# EAGLE board LabFriendMain1 (EAGLE 7.7.0), part 1 of 4
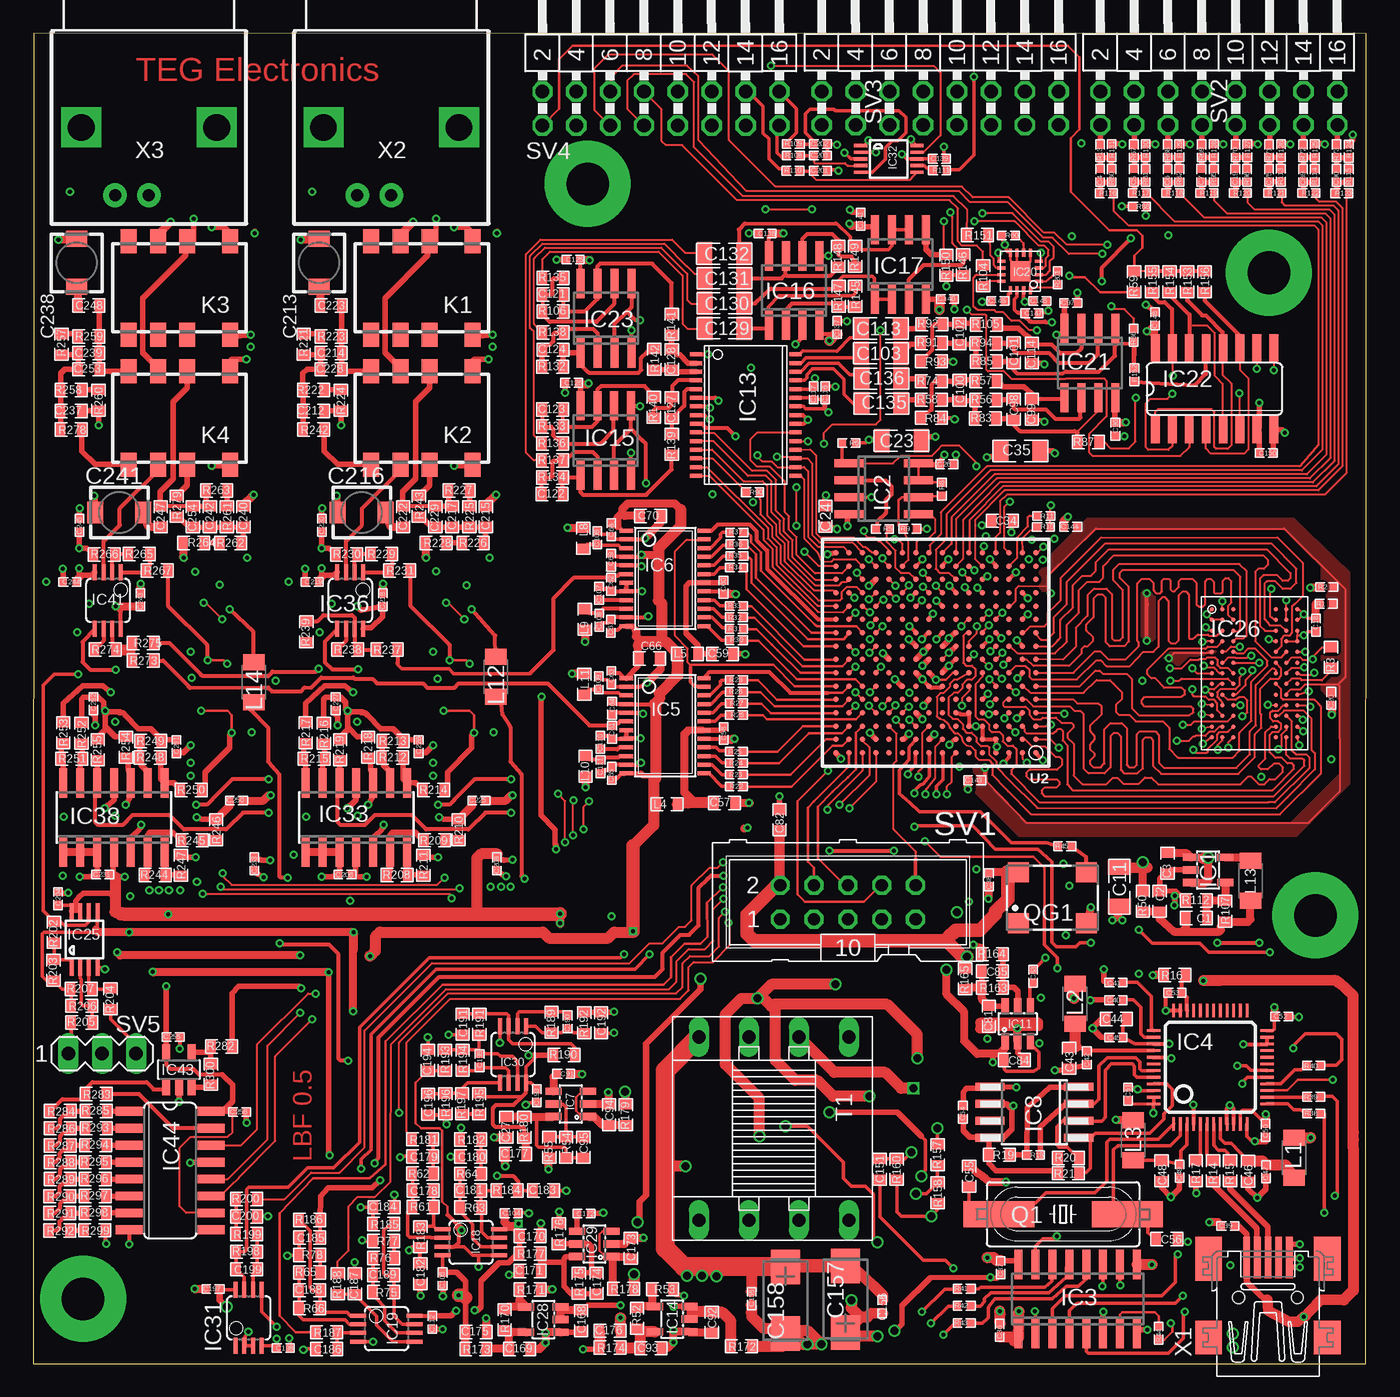
[diagram p13: board, top side]
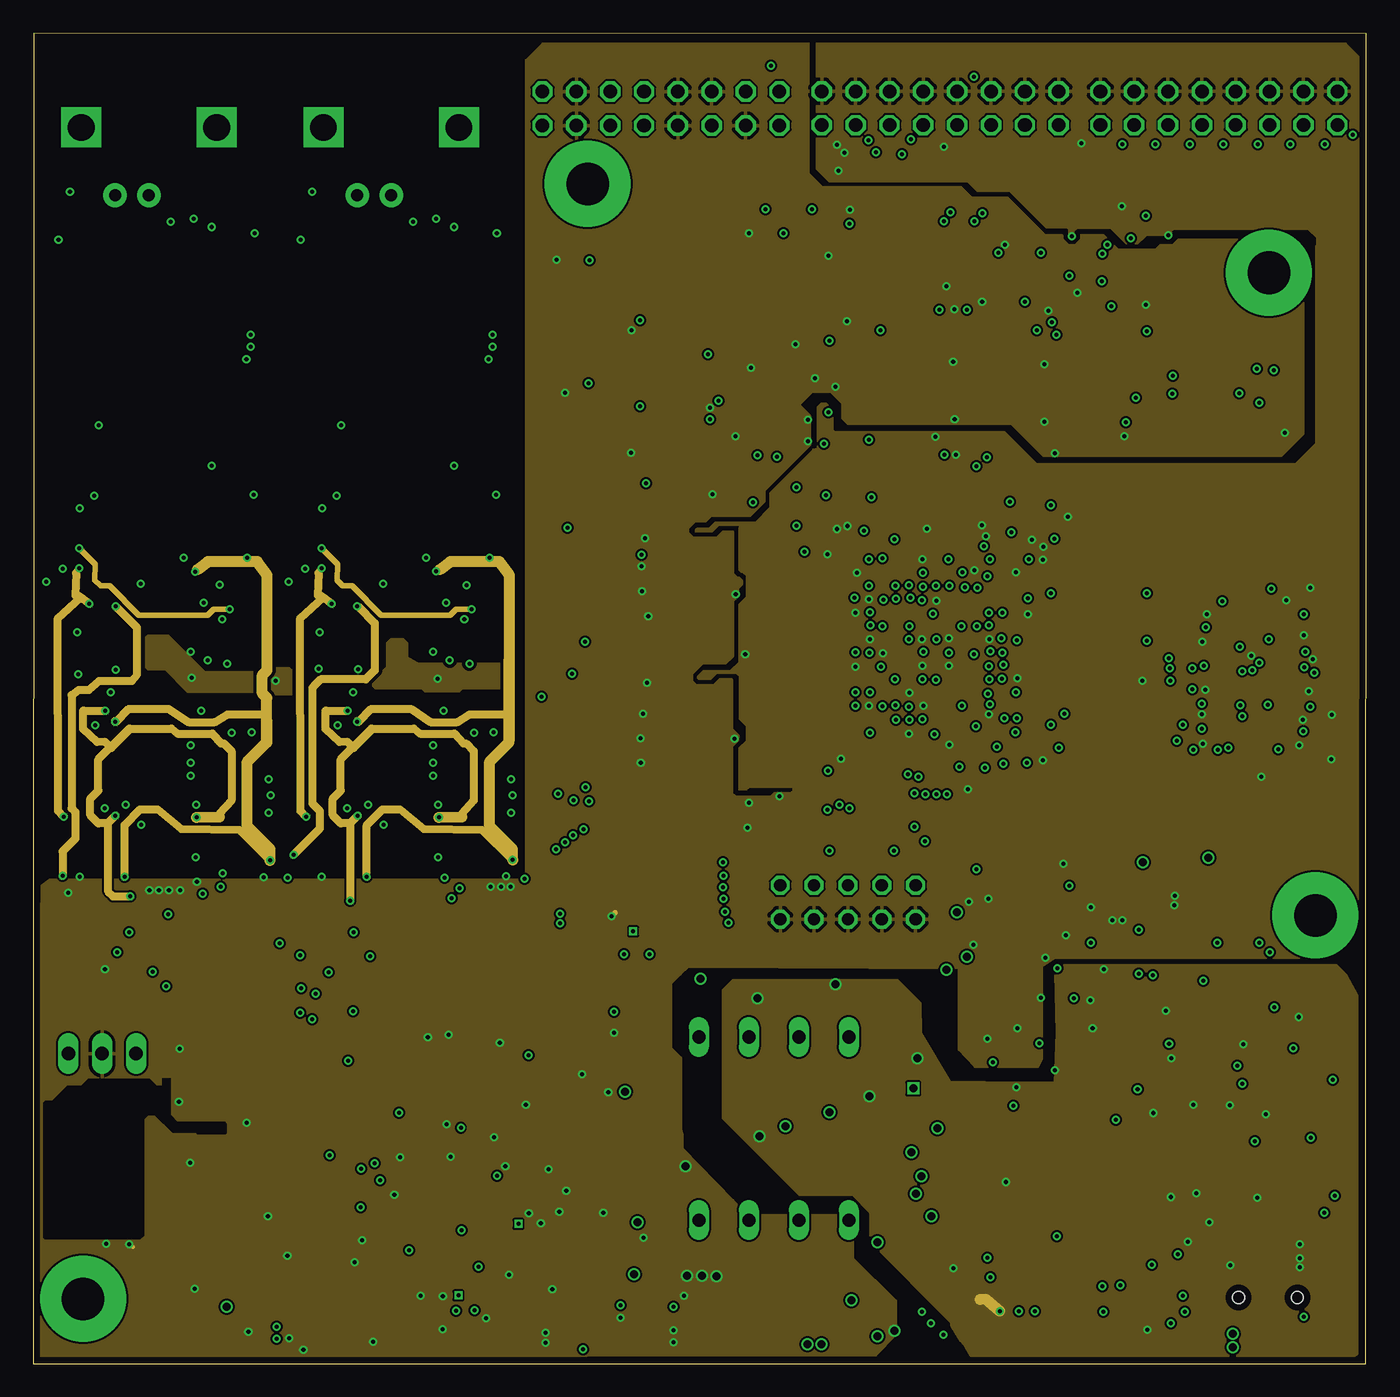
[diagram p14: board, inner layer Route2]
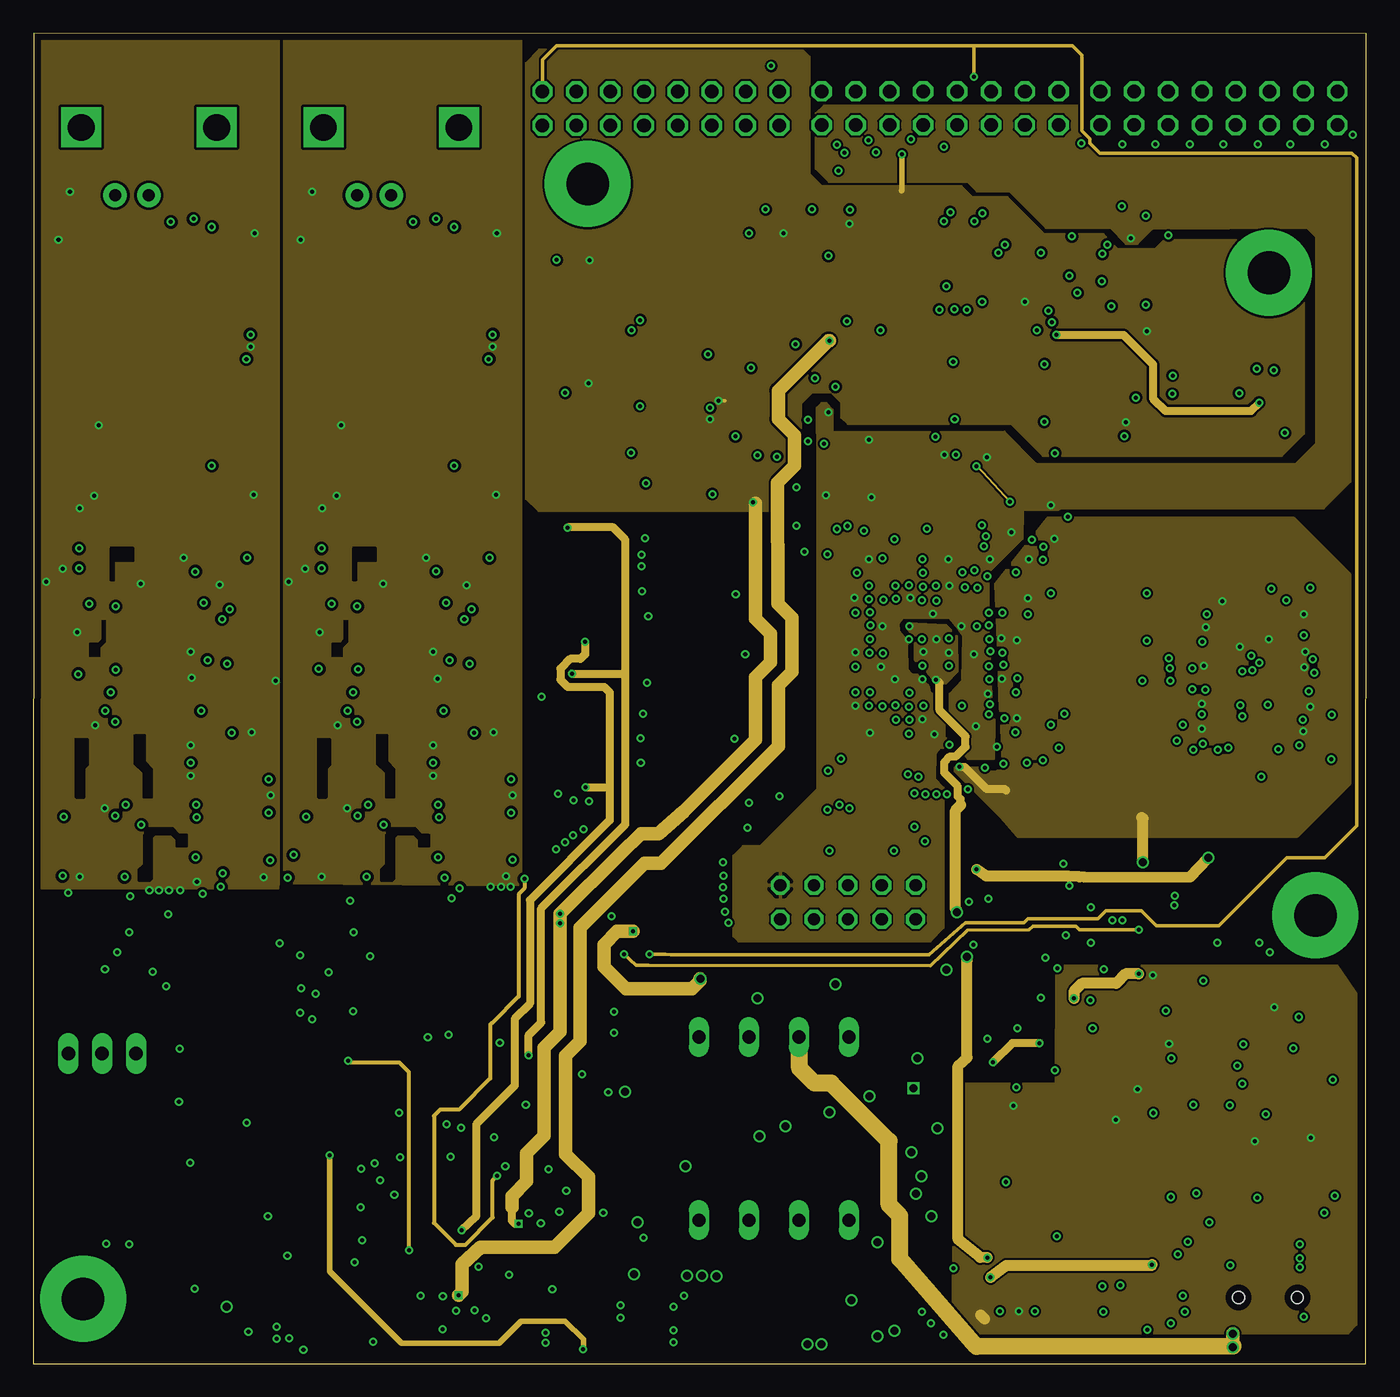
[diagram p15: board, inner layer Route3]
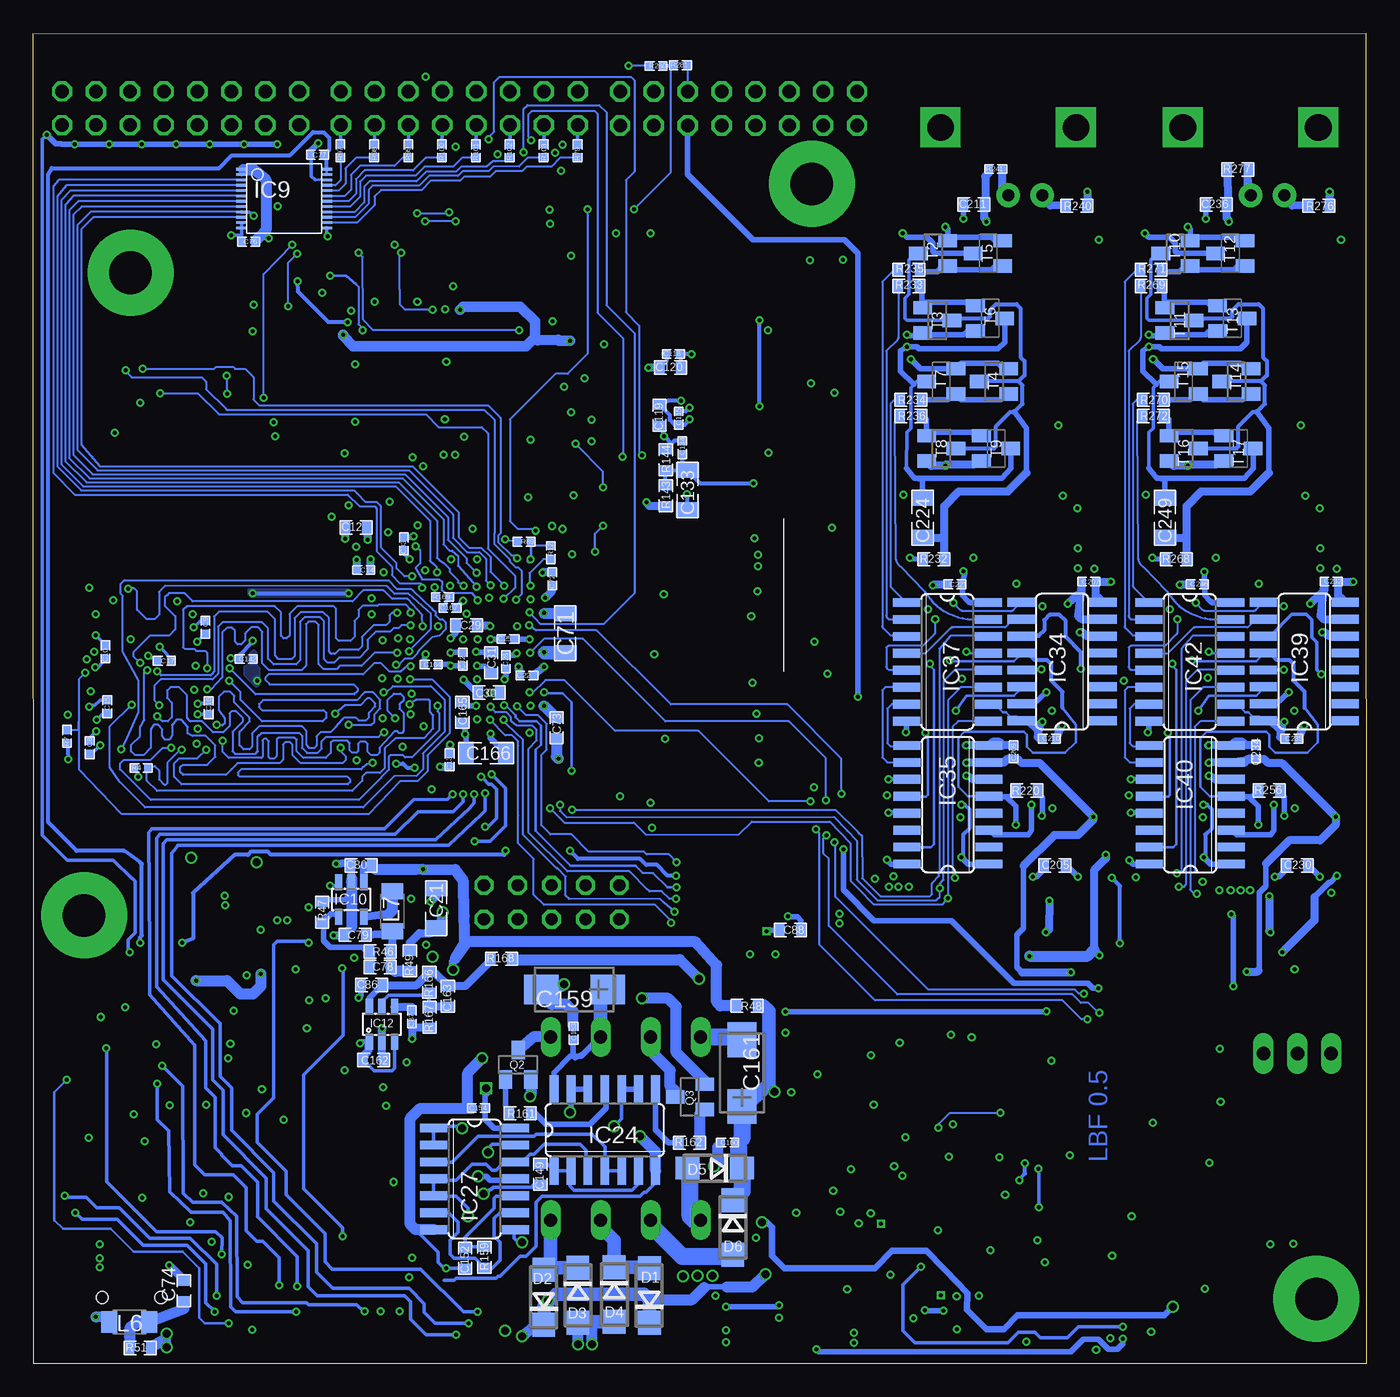
[diagram p16: board, bottom side, seen from below]

Size 100 x 99.78 mm. Coordinates in mm from the lower left corner, seen from the top.
Outline: 0,0 99.98,0 100,99.75 0.02,99.78 0,0
Copper layers (1+2*3+16): Top 0.035mm / dielectric 0.3mm / Route2 0.035mm / dielectric 0.7mm / Route3 0.035mm / dielectric 0.3mm / Bottom 0.035mm
Design rules "default *": minimum track width 0.15mm, minimum drill 0.3mm, track to track 0.15mm, track to pad 0.15mm, pad to pad 0.15mm, via to via 0.15mm, smd to smd 0mil, copper to edge 20mil, drill to drill 8mil, minimum pad ring 10mil, minimum via ring 0.15mm, stop-mask expansion 4mil, vias tented up to drill 16mil, thermal gap 10mil

## Footprints (pad centres in the part's own frame; a part is rotated, then mirrored left to right if it is on the bottom)
0603 = smd 0.762 x 0.965: 1 -0.787,0; 2 0.787,0
0402 = smd 0.635 x 0.635: 1 -0.498,0; 2 0.523,0
1206 = smd 1.143 x 1.702: 1 -1.473,0; 2 1.473,0
CT6032 = smd 2.6 x 2.2: + -2.5,0; - 2.5,0
CTRIMTZBX4 = smd 1.6 x 1.2: 1 0,1.8; 2 0,-1.8
DO214AC = smd 1.8 x 1.7: A 2.05,0; C -2.05,0
SOT23-5L = smd 0.55 x 1.2: 1 -0.95,-1.3; 2 0,-1.3; 3 0.95,-1.3; 4 0.95,1.3; 5 -0.95,1.3
SO-08 = smd 0.6 x 2.2: 1 -1.905,-2.6; 2 -0.635,-2.6; 3 0.635,-2.6; 4 1.905,-2.6; 5 1.905,2.6; 6 0.635,2.6; 7 -0.635,2.6; 8 -1.905,2.6
SO16 = smd 0.6 x 2.2: 1 -4.445,-2.6; 2 -3.175,-2.6; 3 -1.905,-2.6; 4 -0.635,-2.6; 5 0.635,-2.6; 6 1.905,-2.6; 7 3.175,-2.6; 8 4.445,-2.6; 9 4.445,2.6; 10 3.175,2.6; 11 1.905,2.6; 12 0.635,2.6; 13 -0.635,2.6; 14 -1.905,2.6; 15 -3.175,2.6; 16 -4.445,2.6
LQFP48 = smd 0.2 x 1: 1 -2.75,-4.25; 2 -2.25,-4.25; 3 -1.75,-4.25; 4 -1.25,-4.25; 5 -0.75,-4.25; 6 -0.25,-4.25; 7 0.25,-4.25; 8 0.75,-4.25; 9 1.25,-4.25; 10 1.75,-4.25; 11 2.25,-4.25; 12 2.75,-4.25; 25 2.75,4.25; 26 2.25,4.25; 27 1.75,4.25; 28 1.25,4.25; 29 0.75,4.25; 30 0.25,4.25; 31 -0.25,4.25; 32 -0.75,4.25; 33 -1.25,4.25; 34 -1.75,4.25; 35 -2.25,4.25; 36 -2.75,4.25 | smd 1 x 0.2: 13 4.25,-2.75; 14 4.25,-2.25; 15 4.25,-1.75; 16 4.25,-1.25; 17 4.25,-0.75; 18 4.25,-0.25; 19 4.25,0.25; 20 4.25,0.75; 21 4.25,1.25; 22 4.25,1.75; 23 4.25,2.25; 24 4.25,2.75; 37 -4.25,2.75; 38 -4.25,2.25; 39 -4.25,1.75; 40 -4.25,1.25; 41 -4.25,0.75; 42 -4.25,0.25; 43 -4.25,-0.25; 44 -4.25,-0.75; 45 -4.25,-1.25; 46 -4.25,-1.75; 47 -4.25,-2.25; 48 -4.25,-2.75
TSSOP24 = smd 0.305 x 0.991: 1 -3.575,-2.918; 2 -2.925,-2.918; 3 -2.275,-2.918; 4 -1.625,-2.918; 5 -0.975,-2.918; 6 -0.325,-2.918; 7 0.325,-2.918; 8 0.975,-2.918; 9 1.625,-2.918; 10 2.275,-2.918; 11 2.925,-2.918; 12 3.575,-2.918; 13 3.575,2.918; 14 2.925,2.918; 15 2.275,2.918; 16 1.625,2.918; 17 0.975,2.918; 18 0.325,2.918; 19 -0.325,2.918; 20 -0.975,2.918; 21 -1.625,2.918; 22 -2.275,2.918; 23 -2.925,2.918; 24 -3.575,2.918
SOT23-6L = smd 0.55 x 1.2: 1 -0.95,-1.3; 2 0,-1.3; 3 0.95,-1.3; 4 0.95,1.3; 5 0,1.3; 6 -0.95,1.3
SO-08M = smd 0.6 x 2.2: 1 -1.905,-3.33; 2 -0.635,-3.33; 3 0.635,-3.33; 4 1.905,-3.33; 5 1.905,3.33; 6 0.635,3.33; 7 -0.635,3.33; 8 -1.905,3.33
R-PDSO-G24 = smd 0.8 x 0.2: 1 -3.2,2.8; 2 -3.2,2.4; 3 -3.2,2; 4 -3.2,1.6; 5 -3.2,1.2; 6 -3.2,0.8; 7 -3.2,0.4; 8 -3.2,0; 9 -3.2,-0.4; 10 -3.2,-0.8; 11 -3.2,-1.2; 12 -3.2,-1.6; 13 3.2,-1.6; 14 3.2,-1.2; 15 3.2,-0.8; 16 3.2,-0.4; 17 3.2,0; 18 3.2,0.4; 19 3.2,0.8; 20 3.2,1.2; 21 3.2,1.6; 22 3.2,2; 23 3.2,2.4; 24 3.2,2.8
VSOP30 = smd 0.3 x 0.9: 1 -3.82,-3.75; 2 -3.17,-3.75; 3 -2.52,-3.75; 4 -1.87,-3.75; 5 -1.22,-3.75; 6 -0.57,-3.75; 7 0.08,-3.75; 8 0.73,-3.75; 9 1.38,-3.75; 10 2.03,-3.75; 11 2.68,-3.75; 12 3.33,-3.75; 13 3.98,-3.75; 14 4.63,-3.75; 15 5.28,-3.75; 16 5.28,3.725; 17 4.63,3.725; 18 3.98,3.725; 19 3.33,3.725; 20 2.68,3.725; 21 2.03,3.725; 22 1.38,3.725; 23 0.73,3.725; 24 0.08,3.725; 25 -0.57,3.725; 26 -1.22,3.725; 27 -1.87,3.725; 28 -2.52,3.725; 29 -3.17,3.725; 30 -3.82,3.725
SO08 = smd 0.6 x 2.2: 1 -1.905,-2.6; 2 -0.635,-2.6; 3 0.635,-2.6; 4 1.905,-2.6; 5 1.905,2.6; 6 0.635,2.6; 7 -0.635,2.6; 8 -1.905,2.6
MSOP08 = smd 0.3 x 1.2: 1 -0.976,-2.113; 2 -0.326,-2.113; 3 0.324,-2.113; 4 0.974,-2.113; 5 0.974,2.112; 6 0.324,2.112; 7 -0.326,2.112; 8 -0.976,2.112
TQFN3X3 = smd 0.6 x 0.23: 1 -1.4,0.75; 2 -1.4,0.25; 3 -1.4,-0.25; 4 -1.4,-0.75; 9 1.4,-0.75; 10 1.4,-0.25; 11 1.4,0.25; 12 1.4,0.75 | smd 0.23 x 0.6: 5 -0.75,-1.4; 6 -0.25,-1.4; 7 0.25,-1.4; 8 0.75,-1.4; 13 0.75,1.4; 14 0.25,1.4; 15 -0.25,1.4; 16 -0.75,1.4 | smd 1.5 x 1.5: GPD 0,0
SO16' = smd 0.66 x 2.032: 1 -4.445,-3.073; 2 -3.175,-3.073; 3 -1.905,-3.073; 4 -0.635,-3.073; 5 0.635,-3.073; 6 1.905,-3.073; 7 3.175,-3.073; 8 4.445,-3.073; 9 4.445,3.073; 10 3.175,3.073; 11 1.905,3.073; 12 0.635,3.073; 13 -0.635,3.073; 14 -1.905,3.073; 15 -3.175,3.073; 16 -4.445,3.073
SO14 = smd 0.66 x 2.032: 1 -3.81,-3.073; 2 -2.54,-3.073; 3 -1.27,-3.073; 4 0,-3.073; 5 1.27,-3.073; 6 2.54,-3.073; 7 3.81,-3.073; 8 3.81,3.073; 9 2.54,3.073; 10 1.27,3.073; 11 0,3.073; 12 -1.27,3.073; 13 -2.54,3.073; 14 -3.81,3.073
FBGA78 = smd 0.35 x 0.35: A1 -3.2,4.8; A2 -2.4,4.8; A3 -1.6,4.8; A7 1.6,4.8; A8 2.4,4.8; A9 3.2,4.8; B1 -3.2,4; B2 -2.4,4; B3 -1.6,4; B7 1.6,4; B8 2.4,4; B9 3.2,4; C1 -3.2,3.2; C2 -2.4,3.2; C3 -1.6,3.2; C7 1.6,3.2; C8 2.4,3.2; C9 3.2,3.2; D1 -3.2,2.4; D2 -2.4,2.4; D3 -1.6,2.4; D7 1.6,2.4; D8 2.4,2.4; D9 3.2,2.4; E1 -3.2,1.6; E2 -2.4,1.6; E3 -1.6,1.6; E7 1.6,1.6; E8 2.4,1.6; E9 3.2,1.6; F1 -3.2,0.8; F2 -2.4,0.8; F3 -1.6,0.8; F7 1.6,0.8; F8 2.4,0.8; F9 3.2,0.8; G1 -3.2,0; G2 -2.4,0; G3 -1.6,0; G7 1.6,0; G8 2.4,0; G9 3.2,0; H1 -3.2,-0.8; H2 -2.4,-0.8; H3 -1.6,-0.8; H7 1.6,-0.8; H8 2.4,-0.8; H9 3.2,-0.8; J1 -3.2,-1.6; J2 -2.4,-1.6; J3 -1.6,-1.6; J7 1.6,-1.6; J8 2.4,-1.6; J9 3.2,-1.6; K1 -3.2,-2.4; K2 -2.4,-2.4; K3 -1.6,-2.4; K7 1.6,-2.4; K8 2.4,-2.4; K9 3.2,-2.4; L1 -3.2,-3.2; L2 -2.4,-3.2; L3 -1.6,-3.2; L7 1.6,-3.2; L8 2.4,-3.2; L9 3.2,-3.2; M1 -3.2,-4; M2 -2.4,-4; M3 -1.6,-4; M7 1.6,-4; M8 2.4,-4; M9 3.2,-4; N1 -3.2,-4.8; N2 -2.4,-4.8; N3 -1.6,-4.8; N7 1.6,-4.8; N8 2.4,-4.8; N9 3.2,-4.8
MSOP10 = smd 0.25 x 1: 1 -1,-2.113; 2 -0.5,-2.113; 3 0,-2.113; 4 0.5,-2.113; 5 1,-2.113; 6 1,2.113; 7 0.5,2.113; 8 0,2.113; 9 -0.5,2.113; 10 -1,2.113
SO14' = smd 0.6 x 2.2: 1 -3.81,-2.6; 2 -2.54,-2.6; 3 -1.27,-2.6; 4 0,-2.6; 5 1.27,-2.6; 6 2.54,-2.6; 7 3.81,-2.6; 8 3.81,2.6; 9 2.54,2.6; 10 1.27,2.6; 11 0,2.6; 12 -1.27,2.6; 13 -2.54,2.6; 14 -3.81,2.6
SOT23-5 = smd 0.6 x 1.2: 1 -0.95,-1.306; 2 0,-1.306; 3 0.95,-1.306; 4 0.95,1.306; 5 -0.95,1.306
G6K-2F-Y = smd 1.2 x 1.8: 1 -3.8,-3.5; 2 -0.6,-3.5; 3 1.6,-3.5; 4 3.8,-3.5; 5 3.8,3.5; 6 1.6,3.5; 7 -0.6,3.5; 8 -3.8,3.5
L3216C = smd 1.2 x 1.6: 1 -1.5,0; 2 1.5,0
HC49UP = smd 5.334 x 1.93: 1 -4.826,0; 2 4.826,0
SOT23 = smd 1 x 1.4: 1 -0.95,-1.1; 2 0.95,-1.1; 3 0,1.1
SM77H = smd 1.6 x 1.5: 1 -2.55,-1.9; 2 2.55,-1.9; 3 2.55,1.9; 4 -2.55,1.9
ML10 = drill 0.914 octagon: 1 -5.08,-1.27; 2 -5.08,1.27; 3 -2.54,-1.27; 4 -2.54,1.27; 5 0,-1.27; 6 0,1.27; 7 2.54,-1.27; 8 2.54,1.27; 9 5.08,-1.27; 10 5.08,1.27
MA08-2W = drill 1.016 octagon: 1 -8.89,-1.27; 2 -8.89,1.27; 3 -6.35,-1.27; 4 -6.35,1.27; 5 -3.81,-1.27; 6 -3.81,1.27; 7 -1.27,-1.27; 8 -1.27,1.27; 9 1.27,-1.27; 10 1.27,1.27; 11 3.81,-1.27; 12 3.81,1.27; 13 6.35,-1.27; 14 6.35,1.27; 15 8.89,-1.27; 16 8.89,1.27
MA03-1 = drill 1.016 long: 1 -2.54,0; 2 0,0; 3 2.54,0
B66414-W1008-D1 = drill 1 long: 1 -3.75,0; 2 0,0; 3 3.75,0; 4 7.5,0; 5 7.5,13.75; 6 3.75,13.75; 7 0,13.75; 8 -3.75,13.75
SOT23-BEC = smd 1 x 1.4: B -0.95,-1.1; C 0,1.1; E 0.95,-1.1
FT256 = smd 0.4 x 0.4: A1 -7.5,7.5; A2 -6.5,7.5; A3 -5.5,7.5; A4 -4.5,7.5; A5 -3.5,7.5; A6 -2.5,7.5; A7 -1.5,7.5; A8 -0.5,7.5; A9 0.5,7.5; A10 1.5,7.5; A11 2.5,7.5; A12 3.5,7.5; A13 4.5,7.5; A14 5.5,7.5; A15 6.5,7.5; A16 7.5,7.5; B1 -7.5,6.5; B2 -6.5,6.5; B3 -5.5,6.5; B4 -4.5,6.5; B5 -3.5,6.5; B6 -2.5,6.5; B7 -1.5,6.5; B8 -0.5,6.5; B9 0.5,6.5; B10 1.5,6.5; B11 2.5,6.5; B12 3.5,6.5; B13 4.5,6.5; B14 5.5,6.5; B15 6.5,6.5; B16 7.5,6.5; C1 -7.5,5.5; C2 -6.5,5.5; C3 -5.5,5.5; C4 -4.5,5.5; C5 -3.5,5.5; C6 -2.5,5.5; C7 -1.5,5.5; C8 -0.5,5.5; C9 0.5,5.5; C10 1.5,5.5; C11 2.5,5.5; C12 3.5,5.5; C13 4.5,5.5; C14 5.5,5.5; C15 6.5,5.5; C16 7.5,5.5; D1 -7.5,4.5; D2 -6.5,4.5; D3 -5.5,4.5; D4 -4.5,4.5; D5 -3.5,4.5; D6 -2.5,4.5; D7 -1.5,4.5; D8 -0.5,4.5; D9 0.5,4.5; D10 1.5,4.5; D11 2.5,4.5; D12 3.5,4.5; D13 4.5,4.5; D14 5.5,4.5; D15 6.5,4.5; D16 7.5,4.5; E1 -7.5,3.5; E2 -6.5,3.5; E3 -5.5,3.5; E4 -4.5,3.5; E5 -3.5,3.5; E6 -2.5,3.5; E7 -1.5,3.5; E8 -0.5,3.5; E9 0.5,3.5; E10 1.5,3.5; E11 2.5,3.5; E12 3.5,3.5; E13 4.5,3.5; E14 5.5,3.5; E15 6.5,3.5; E16 7.5,3.5; F1 -7.5,2.5; F2 -6.5,2.5; F3 -5.5,2.5; F4 -4.5,2.5; F5 -3.5,2.5; F6 -2.5,2.5; F7 -1.5,2.5; F8 -0.5,2.5; F9 0.5,2.5; F10 1.5,2.5; F11 2.5,2.5; F12 3.5,2.5; F13 4.5,2.5; F14 5.5,2.5; F15 6.5,2.5; F16 7.5,2.5; G1 -7.5,1.5; G2 -6.5,1.5; G3 -5.5,1.5; G4 -4.5,1.5; G5 -3.5,1.5; G6 -2.5,1.5; G7 -1.5,1.5; G8 -0.5,1.5; G9 0.5,1.5; G10 1.5,1.5; G11 2.5,1.5; G12 3.5,1.5; G13 4.5,1.5; G14 5.5,1.5; G15 6.5,1.5; G16 7.5,1.5; H1 -7.5,0.5; H2 -6.5,0.5; H3 -5.5,0.5; H4 -4.5,0.5; H5 -3.5,0.5; H6 -2.5,0.5; H7 -1.5,0.5; H8 -0.5,0.5; H9 0.5,0.5; H10 1.5,0.5; H11 2.5,0.5; H12 3.5,0.5; H13 4.5,0.5; H14 5.5,0.5; H15 6.5,0.5; H16 7.5,0.5; J1 -7.5,-0.5; J2 -6.5,-0.5; J3 -5.5,-0.5; J4 -4.5,-0.5; J5 -3.5,-0.5; J6 -2.5,-0.5; J7 -1.5,-0.5; J8 -0.5,-0.5; J9 0.5,-0.5; J10 1.5,-0.5; J11 2.5,-0.5; J12 3.5,-0.5; J13 4.5,-0.5; J14 5.5,-0.5; J15 6.5,-0.5; J16 7.5,-0.5; K1 -7.5,-1.5; K2 -6.5,-1.5; K3 -5.5,-1.5; K4 -4.5,-1.5; K5 -3.5,-1.5; K6 -2.5,-1.5; K7 -1.5,-1.5; K8 -0.5,-1.5; K9 0.5,-1.5; K10 1.5,-1.5; K11 2.5,-1.5; K12 3.5,-1.5; K13 4.5,-1.5; K14 5.5,-1.5; K15 6.5,-1.5; K16 7.5,-1.5; L1 -7.5,-2.5; L2 -6.5,-2.5; L3 -5.5,-2.5; L4 -4.5,-2.5; L5 -3.5,-2.5; L6 -2.5,-2.5; L7 -1.5,-2.5; L8 -0.5,-2.5; L9 0.5,-2.5; L10 1.5,-2.5; L11 2.5,-2.5; L12 3.5,-2.5; L13 4.5,-2.5; L14 5.5,-2.5; L15 6.5,-2.5; L16 7.5,-2.5; M1 -7.5,-3.5; M2 -6.5,-3.5; M3 -5.5,-3.5; M4 -4.5,-3.5; M5 -3.5,-3.5; M6 -2.5,-3.5; M7 -1.5,-3.5; M8 -0.5,-3.5; M9 0.5,-3.5; M10 1.5,-3.5; M11 2.5,-3.5; M12 3.5,-3.5; M13 4.5,-3.5; M14 5.5,-3.5; M15 6.5,-3.5; M16 7.5,-3.5; N1 -7.5,-4.5; N2 -6.5,-4.5; N3 -5.5,-4.5; N4 -4.5,-4.5; N5 -3.5,-4.5; N6 -2.5,-4.5; N7 -1.5,-4.5; N8 -0.5,-4.5; N9 0.5,-4.5; N10 1.5,-4.5; N11 2.5,-4.5; N12 3.5,-4.5; N13 4.5,-4.5; N14 5.5,-4.5; N15 6.5,-4.5; N16 7.5,-4.5; P1 -7.5,-5.5; P2 -6.5,-5.5; P3 -5.5,-5.5; P4 -4.5,-5.5; P5 -3.5,-5.5; P6 -2.5,-5.5; P7 -1.5,-5.5; P8 -0.5,-5.5; P9 0.5,-5.5; P10 1.5,-5.5; P11 2.5,-5.5; P12 3.5,-5.5; P13 4.5,-5.5; P14 5.5,-5.5; P15 6.5,-5.5; P16 7.5,-5.5; R1 -7.5,-6.5; R2 -6.5,-6.5; R3 -5.5,-6.5; R4 -4.5,-6.5; R5 -3.5,-6.5; R6 -2.5,-6.5; R7 -1.5,-6.5; R8 -0.5,-6.5; R9 0.5,-6.5; R10 1.5,-6.5; R11 2.5,-6.5; R12 3.5,-6.5; R13 4.5,-6.5; R14 5.5,-6.5; R15 6.5,-6.5; R16 7.5,-6.5; T1 -7.5,-7.5; T2 -6.5,-7.5; T3 -5.5,-7.5; T4 -4.5,-7.5; T5 -3.5,-7.5; T6 -2.5,-7.5; T7 -1.5,-7.5; T8 -0.5,-7.5; T9 0.5,-7.5; T10 1.5,-7.5; T11 2.5,-7.5; T12 3.5,-7.5; T13 4.5,-7.5; T14 5.5,-7.5; T15 6.5,-7.5; T16 7.5,-7.5
32005-201 = smd 3.1 x 0.5: 1 3,1.6; 2 3,0.8; 3 3,0; 4 3,-0.8; 5 3,-1.6 | smd 2.5 x 2: M1 -3,-4.45; M2 -3,4.45 | smd 3.3 x 2: M3 2.9,4.45; M4 2.9,-4.45 | hole 0.9: 0,2.2; 0,-2.2
AMP_227161 = drill 0.9 pad 1.778: 1 0,-5.08; 2 -2.54,-5.08 | drill 2 square: P$1 -5.08,0; P$2 5.08,0

## Placement (x,y rotation side)
C1  33pF  [0603]  87.25,33.42 180 top
C2  10uF  [0603]  84.51,34.66 270 top
C3  10uF  [0603]  85.1,37.52 90 top
C4  4.7pF  [0402]  80.06,89.11 90 top
C5  4.7pF  [0402]  82.6,89.11 90 top
C6  4.7pF  [0402]  85.13,89.11 90 top
C7  4.7pF  [0402]  87.66,89.11 90 top
C8  470nF  [0402]  95.8,46.23 270 bottom
C9  470nF  [0402]  87.11,55.24 270 bottom
C10  470nF  [0402]  94.56,53.35 90 bottom
C11  100uF  [1206]  81.49,35.75 270 top
C12  10uF  [0603]  75.78,62.71 0 bottom
C13  470nF  [0402]  68.75,45.25 90 bottom
C14  470nF  [0402]  75.2,59.55 180 bottom
C15  470nF  [0402]  94.49,49.27 270 bottom
C16  470nF  [0402]  86.88,49.21 270 bottom
C17  470nF  [0402]  90.16,52.74 180 bottom
C18  470nF  [0402]  96.23,55.41 270 top
C19  4.7pF  [0402]  90.21,89.11 90 top
C20  470nF  [0402]  97.41,49.86 90 top
C21  100uF  [1206]  69.78,34.16 270 bottom
C22  470nF  [0402]  63,51.58 0 bottom
C23  100uF  [1206]  65.15,69.21 0 top
C24  10uF  [0603]  59.44,63.54 270 top
C25  470nF  [0402]  64.43,54.33 0 bottom
C26  100nF  [0402]  68.53,67.43 0 top
C27  10uF  [0603]  35.5,17.74 90 top
C28  470nF  [0402]  64.54,52.6 90 bottom
C29  4u7  [0603]  67.51,55.38 180 bottom
C30  4u7  [0603]  65.8,50.34 0 bottom
C31  4u7  [0603]  65.66,52.56 270 bottom
C32  470nF  [0402]  67.81,52.85 270 bottom
C33  470nF  [0402]  72.19,61.46 90 bottom
C34  10uF  [0603]  72.7,63.21 180 top
C35  100uF  [1206]  74.05,68.45 0 top
C36  100nF  [0402]  72.53,2.48 90 top
C37  100nF  [0402]  72.56,7.22 270 top
C38  100nF  [0402]  71.67,36.31 270 top
C39  10nF  [0402]  89.65,10.36 180 top
C40  100nF  [0402]  81.25,27.28 180 top
C41  100nF  [0402]  81.25,28.6 180 top
C42  100nF  [0402]  79.07,22.91 90 top
C43  10uF  [0603]  77.72,22.91 90 top
C44  10uF  [0603]  81.25,25.86 180 top
C45  100nF  [0402]  81.25,24.49 180 top
C46  10uF  [0603]  91.14,14.43 270 top
C47  100nF  [0402]  92.46,14.43 270 top
C48  10uF  [0603]  84.66,14.45 270 top
C49  100nF  [0402]  85.98,14.45 270 top
C50  100nF  [0402]  92.48,17.48 90 top
C51  100nF  [0402]  82.11,20.24 270 top
C52  100nF  [0402]  93.66,26.01 0 top
C53  10nF  [0402]  85.67,27.84 180 top
C54  100nF  [0402]  69.77,18.85 90 top
C55  27pF  [0603]  70.21,14.05 270 top
C56  27pF  [0603]  85.06,9.35 180 top
C57  10uF  [0603]  51.86,42.05 0 top
C58  100nF  [0402]  51.78,47.29 270 top
C59  10uF  [0603]  51.72,53.23 0 top
C60  100nF  [0402]  51.75,58.26 270 top
C61  10pF  [0402]  43.4,47.36 270 top
C62  10pF  [0402]  43.32,58.46 270 top
C63  100nF  [0402]  43.35,51.48 270 top
C64  100nF  [0402]  43.4,49.19 270 top
C65  100nF  [0402]  43.42,44.24 90 top
C66  10uF  [0603]  46.22,52.87 0 top
C67  100nF  [0402]  43.35,55.29 90 top
C68  100nF  [0402]  43.35,62.55 270 top
C69  100nF  [0402]  43.32,60.29 270 top
C70  10uF  [0603]  46.3,63.58 0 top
C71  100uF  [1206]  60.1,54.79 90 bottom
C72  470nF  [0402]  61.04,58.85 90 bottom
C73  10uF  [0603]  60.75,47.67 270 bottom
C74  10uF  [0603]  88.7,5.45 90 bottom
C75  4.7pF  [0402]  92.75,89.11 90 top
C76  100nF  [0402]  83.84,84.17 180 bottom
C77  100nF  [0402]  78.71,90.64 0 bottom
C78  33pF  [0603]  73.99,29.75 0 bottom
C79  10uF  [0603]  75.87,32.17 0 bottom
C80  10uF  [0603]  75.42,37.37 0 bottom
C81  10uF  [0603]  71.7,26.05 90 top
C82  10uF  [0603]  55.98,40.78 270 top
C83  10nF  [0402]  74.99,29.06 270 top
C84  1uF  [0603]  73.61,22.76 180 top
C85  15pF  [0603]  71.96,29.43 180 top
C86  10uF  [0603]  74.61,28.39 0 bottom
C87  10nF  [0402]  71.59,25.98 90 bottom
C88  10uF  [0603]  43.19,32.51 180 bottom
C89  4.7pF  [0402]  95.3,89.11 90 top
C90  4.7pF  [0402]  97.8,89.11 90 top
C91  10nF  [0402]  39.81,21.76 180 top
C92  10uF  [0603]  50.91,3.11 270 top
C93  10uF  [0603]  46.34,1.16 0 top
C94  1uF  [0603]  43.2,18.68 270 top
C95  15pF  [0603]  41.28,16.21 270 top
C96  100nF  [0402]  81.16,70.09 270 top
C97  100nF  [0402]  77.83,79.53 0 top
C98  330pF  [0603]  73.55,71.58 270 top
C99  330pF  [0603]  74.93,71.56 90 top
C100  2n2  [0603]  69.5,72.99 270 top
C101  330pF  [0603]  73.55,75.81 270 top
C102  2n2  [0603]  69.49,77.24 270 top
C103  47uF  [1206]  63.61,75.78 0 top
C104  100nF  [0402]  35.86,11.31 180 top
C105  100nF  [0402]  30.73,6.33 90 top
C106  100nF  [0402]  42.33,61.92 90 top
C107  100nF  [0402]  42.47,57.76 90 top
C108  100nF  [0402]  42.43,55.8 270 top
C109  100nF  [0402]  42.46,51.05 90 top
C110  100nF  [0402]  42.57,46.59 90 top
C111  100nF  [0402]  42.53,44.8 270 top
C112  100nF  [0402]  29.96,3.08 90 top
C113  47uF  [1206]  63.6,77.64 0 top
C114  330pF  [0603]  74.93,75.8 90 top
C115  100nF  [0402]  51.61,70.94 270 bottom
C116  100nF  [0402]  59.45,72.79 90 top
C117  100nF  [0402]  58.58,72.78 90 top
C118  100nF  [0402]  52.01,75.71 0 bottom
C119  10uF  [0603]  53.03,71.12 90 bottom
C120  10uF  [0603]  52.21,74.7 0 bottom
C121  330pF  [0603]  38.99,80.2 0 top
C122  330pF  [0603]  38.94,65.21 0 top
C123  330pF  [0603]  38.98,71.55 0 top
C124  330pF  [0603]  38.99,76.05 0 top
C125  100nF  [0402]  40.53,82.84 180 top
C126  100nF  [0402]  40.43,73.59 180 top
C127  10nF  [0603]  47.91,71.7 90 top
C128  10nF  [0603]  47.9,75.31 90 top
C129  47uF  [1206]  51.85,77.66 180 top
C130  47uF  [1206]  51.85,79.53 180 top
C131  47uF  [1206]  51.85,81.4 180 top
C132  47uF  [1206]  51.84,83.25 180 top
C133  47uF  [1206]  50.93,65.53 90 bottom
C134  100nF  [0402]  51.34,68.71 270 bottom
C135  47uF  [1206]  63.62,72 0 top
C136  47uF  [1206]  63.62,73.88 0 top
C137  100nF  [0402]  60.34,77.7 90 top
C138  100nF  [0402]  54.94,84.79 180 top
C139  100nF  [0402]  67.98,90.35 0 top
C140  100nF  [0402]  68.58,79.84 0 top
C141  100nF  [0402]  62.1,85.83 90 top
C142  470nF  [0402]  84.01,52.88 180 bottom
C143  470nF  [0402]  70.63,43.73 0 top
C144  470nF  [0402]  77.81,62.74 0 top
C145  100nF  [0402]  75.51,79.67 0 top
C146  100nF  [0402]  72.36,79.67 0 top
C147  100nF  [0402]  74.94,78.81 180 top
C148  100nF  [0402]  84.19,78.36 90 top
C149  100pF  [0603]  61.97,14.2 90 bottom
C150  100nF  [0402]  92.53,68.31 180 top
C151  47pF  [0603]  63.51,14.59 90 top
C152  47pF  [0603]  67.6,7.9 90 bottom
C153  100nF  [0402]  59.49,24.8 270 bottom
C154  100nF  [0402]  66.62,19.14 0 bottom
C155  100nF  [0402]  53.87,4.91 270 top
C156  100nF  [0402]  63.71,4.25 90 top
C157  100uF  [CT6032]  60.93,4.83 90 top
C158  100uF  [CT6032]  56.43,4.75 270 top
C159  100uF  [CT6032]  59.4,28.07 180 bottom
C160  100nF  [0402]  47.88,16.61 180 bottom
C161  100uF  [CT6032]  46.83,21.79 90 bottom
C162  1uF  [0603]  74.46,22.77 180 bottom
C163  15pF  [0603]  68.9,27.54 90 bottom
C164  470nF  [0402]  70.14,52.46 180 bottom
C165  10uF  [0603]  67.81,48.85 270 bottom
C166  100uF  [1206]  66.05,45.79 180 bottom
C167  470nF  [0402]  68.78,56.65 0 bottom
C168  10uF  [0603]  41.1,3.23 270 top
C169  10uF  [0603]  36.5,1.1 0 top
C170  10uF  [0603]  37.29,9.56 180 top
C171  10uF  [0603]  37.26,6.95 0 top
C172  10nF  [0402]  41.34,11.28 180 top
C173  1uF  [0603]  44.83,8.64 270 top
C174  15pF  [0603]  42.26,6.04 270 top
C175  10uF  [0603]  33.21,2.38 0 top
C176  10uF  [0603]  43.26,2.46 0 top
C177  10uF  [0603]  36.19,15.71 0 top
C178  1uF  [0603]  29.23,12.99 180 top
C179  10uF  [0603]  29.21,15.54 180 top
C180  10uF  [0603]  32.81,15.53 180 top
C181  1uF  [0603]  32.8,12.97 0 top
C182  10uF  [0603]  29.03,6.75 270 top
C183  10uF  [0603]  38.29,12.97 0 top
C184  10uF  [0603]  26.3,11.72 0 top
C185  10uF  [0603]  20.73,9.46 180 top
C186  10uF  [0603]  22,1.1 180 top
C187  10uF  [0603]  24.11,5.97 90 top
C188  1uF  [0603]  20.74,5.5 0 top
C189  1uF  [0603]  26.29,6.64 0 top
C190  10nF  [0402]  40.11,25.6 90 top
C191  1uF  [0603]  32.21,25.45 270 top
C192  10uF  [0603]  42.6,25.56 270 top
C193  100nF  [0402]  37.8,20.07 90 top
C194  10uF  [0603]  29.6,22.75 90 top
C195  10nF  [0402]  33.46,22.75 270 top
C196  1uF  [0603]  29.61,19.46 270 top
C197  100nF  [0402]  13.45,5.56 0 top
C198  100nF  [0402]  18.78,1.19 180 top
C199  1uF  [0603]  16.01,7.08 180 top
C200  10uF  [0603]  15.99,11.04 0 top
C201  10nF  [0402]  59.05,89.45 0 top
C202  10nF  [0402]  59.05,91.45 0 top
C203  10nF  [0402]  59.05,90.59 0 top
C204  100nF  [0402]  1.83,34.9 270 top
C205  10uF  [0603]  23.35,37.37 180 bottom
C206  100nF  [0402]  23.37,36.66 0 top
C207  100nF  [0402]  20.83,58.63 0 bottom
C208  100nF  [0402]  34.8,37.47 90 top
C209  100nF  [0402]  26.42,45.85 90 bottom
C210  100nF  [0402]  23.75,46.9 180 bottom
C211  100nF  [0603]  29.44,86.93 0 bottom
C212  12pF  [0603]  21.02,71.46 180 top
C213  6/30  [CTRIMTZBX4]  21.44,82.56 180 top
C214  12pF  [0603]  22.33,75.8 0 top
C215  220pF  [0603]  33.94,63.53 270 top
C216  6/30  [CTRIMTZBX4]  24.64,63.84 270 top
C217  12pF  [0603]  31.43,63.53 90 top
C218  100nF  [0402]  26.19,57.31 270 top
C219  100nF  [0402]  20.94,58.66 180 top
C220  100nF  [0402]  21.62,62.9 270 top
C221  100nF  [0402]  30.87,58.43 0 bottom
C222  12pF  [0603]  27.74,63.53 90 top
C223  12pF  [0603]  22.33,79.36 0 top
C224  100uF  [1206]  33.28,63.43 90 bottom
C225  100nF  [0402]  33.41,42.22 0 top
C226  100nF  [0402]  28.89,46.29 270 top
C227  100nF  [0402]  22.66,49.51 270 top
C228  1pF  [0603]  22.33,74.58 0 top
C229  1pF  [0603]  30.16,63.53 90 top
C230  10uF  [0603]  5.17,37.37 180 bottom
C231  100nF  [0402]  5.19,36.66 0 top
C232  100nF  [0402]  2.65,58.63 0 bottom
C233  100nF  [0402]  16.62,37.47 90 top
C234  100nF  [0402]  8.24,45.85 90 bottom
C235  100nF  [0402]  5.57,46.9 180 bottom
C236  100nF  [0603]  11.26,86.93 0 bottom
C237  12pF  [0603]  2.84,71.46 180 top
C238  6/30  [CTRIMTZBX4]  3.26,82.56 180 top
C239  12pF  [0603]  4.15,75.8 0 top
C240  220pF  [0603]  15.76,63.53 270 top
C241  6/30  [CTRIMTZBX4]  6.46,63.84 270 top
C242  12pF  [0603]  13.24,63.53 90 top
C243  100nF  [0402]  8.01,57.31 270 top
C244  100nF  [0402]  2.75,58.66 180 top
C245  100nF  [0402]  3.44,62.9 270 top
C246  100nF  [0402]  12.68,58.43 0 bottom
C247  12pF  [0603]  9.56,63.53 90 top
C248  12pF  [0603]  4.15,79.36 0 top
C249  100uF  [1206]  15.1,63.43 90 bottom
C250  100nF  [0402]  15.22,42.22 0 top
C251  100nF  [0402]  10.7,46.29 270 top
C252  100nF  [0402]  4.48,49.51 270 top
C253  1pF  [0603]  4.15,74.58 0 top
C254  1pF  [0603]  11.97,63.53 90 top
C255  100nF  [0402]  10.48,24.48 0 top
C256  100nF  [0402]  15.46,18.84 0 top
D1  SK14  [DO214AC]  53.77,5.11 90 bottom
D2  SK14  [DO214AC]  61.7,4.98 90 bottom
D3  SK14  [DO214AC]  59.16,5.12 270 bottom
D4  SK14  [DO214AC]  56.44,5.17 270 bottom
D5  SK14  [DO214AC]  48.87,14.66 180 bottom
D6  SK14  [DO214AC]  47.53,10.2 270 bottom
IC1  TPS62240DDC  [SOT23-5L]  88.14,37.02 270 top
IC2  25px80  [SO-08]  63.81,65.61 270 top
IC3  SI8462  [SO16]  78.36,4.84 0 top
IC4  FT232H  [LQFP48]  88.32,22.23 0 top
IC5  ADC08200  [TSSOP24]  47.41,47.84 270 top
IC6  ADC08200  [TSSOP24]  47.41,58.89 270 top
IC7  TPS73001DBVR  [SOT23-6L]  40.33,19.48 90 top
IC8  93LC56SM  [SO-08M]  75.11,18.85 90 top
IC9  74LVC8T245  [R-PDSO-G24]  81.19,86.78 0 bottom
IC10  TPS62240DDC  [SOT23-5L]  76.15,34.81 180 bottom
IC11  TPS73001DBVR  [SOT23-6L]  73.86,25.49 0 top
IC12  TPS73001DBVR  [SOT23-6L]  73.85,25.45 0 bottom
IC13  AK4621  [VSOP30]  53.48,71.88 270 top
IC14  TPS72301  [SOT23-5L]  47.94,3.34 90 top
IC15  LME49721  [SO08]  42.95,69.24 0 top
IC16  NE5532  [SO08]  57.09,80.49 0 top
IC17  OPA2134  [SO08]  65.05,82.45 0 top
IC18  LM8272  [MSOP08]  32.84,9.1 270 top
IC19  LMV358MM  [MSOP08]  26.5,2.62 270 top
IC20  ISL54405IRTZ  [TQFN3X3]  74.05,81.92 180 top
IC21  NE5532  [SO08]  79.26,75.05 180 top
IC22  74HC4052D  [SO16']  88.63,73.11 0 top
IC23  LME49721  [SO08]  42.98,78.41 0 top
IC24  74HC00D  [SO14]  57.13,17.52 0 bottom
IC25  INA331IDGK  [MSOP08]  3.84,31.81 0 top
IC26  MT41J128M8  [FBGA78]  91.63,51.77 0 top
IC27  74HCT132D  [SO14]  66.9,13.86 270 bottom
IC28  TPS72301  [SOT23-5L]  38.28,3.3 90 top
IC29  TPS73001DBVR  [SOT23-6L]  42.1,8.97 90 top
IC30  LM8272  [MSOP08]  35.99,23.18 180 top
IC31  LMV358MM  [MSOP08]  16.16,3.44 0 top
IC32  ADS1118IDGSR  [MSOP10]  64.19,90.36 270 top
IC33  ADA4853-3RU  [SO14']  24.24,40.95 0 top
IC34  4052D  [SO16']  22.81,52.66 90 bottom
IC35  4052D  [SO16']  31.37,41.92 90 bottom
IC36  OPA2354  [MSOP08]  23.78,57.23 180 top
IC37  74HC595D  [SO16']  31.43,52.64 270 bottom
IC38  ADA4853-3RU  [SO14']  6.05,40.95 0 top
IC39  4052D  [SO16']  4.63,52.66 90 bottom
IC40  4052D  [SO16']  13.19,41.92 90 bottom
IC41  OPA2354  [MSOP08]  5.6,57.23 180 top
IC42  74HC595D  [SO16']  13.24,52.64 270 bottom
IC43  LM321MF  [SOT23-5]  10.93,22.05 0 top
IC44  74HC595D  [SO16']  10.26,14.47 270 top
K1  G6K-2F-Y  [G6K-2F-Y]  29.14,80.68 180 top
K2  G6K-2F-Y  [G6K-2F-Y]  29.14,70.92 180 top
K3  G6K-2F-Y  [G6K-2F-Y]  10.96,80.68 180 top
K4  G6K-2F-Y  [G6K-2F-Y]  10.96,70.92 180 top
L1  1µH  [L3216C]  94.59,15.44 90 top
L2  1µH  [L3216C]  78.16,27 90 top
L3  1µH  [L3216C]  82.52,16.76 90 top
L4  220nH  [0603]  47.54,41.95 0 top
L5  220nH  [0603]  49.07,53.23 0 top
L6  470nH  [L3216C]  92.79,3.12 180 bottom
L7  2.2uH  [L3216C]  73.07,33.92 270 bottom
L8  220nH  [0603]  41.26,61.91 270 top
L9  220nH  [0603]  41.39,55.81 90 top
L10  220nH  [0603]  41.44,44.81 90 top
L11  220nH  [0603]  41.35,50.96 270 top
L12  1uH  [L3216C]  34.7,51.51 270 top
L13  2.2uH  [L3216C]  91.33,36.23 270 top
L14  1uH  [L3216C]  16.54,51.11 270 top
Q1  12MHz  [HC49UP]  77.26,11.21 180 top
Q2  FDN335N  [SOT23]  63.63,22.42 0 bottom
Q3  FDN335N  [SOT23]  50.74,20.01 90 bottom
QG1  SM77H  [SM77H]  76.45,34.94 0 top
R1  100R  [0402]  97.03,57.01 180 top
R2  100R  [0402]  97.04,58.21 0 top
R3  240R  [0603]  97.38,52.96 90 top
R4  4k7  [0402]  91.93,44.65 0 bottom
R5  47R  [0402]  63.74,62.63 180 top
R6  4k7  [0402]  61.21,69.08 180 top
R7  4k7  [0402]  97.45,47.01 90 bottom
R8  1M  [0402]  68.14,65.59 270 top
R9  1M  [0402]  65.76,62.59 0 top
R10  4k7  [0402]  75.83,62.77 180 top
R11  4k7  [0402]  75.83,63.6 180 top
R12  330R  [0402]  61.21,60.85 270 bottom
R13  270  [0402]  80.06,90.94 90 top
R14  0R  [0603]  88.52,14.45 90 top
R15  0R  [0603]  89.79,14.45 270 top
R16  10k  [0603]  85.65,29.16 180 top
R17  12k  [0603]  87.22,14.48 90 top
R18  2k2  [0402]  75.06,15.67 180 top
R19  10k  [0603]  72.47,15.67 180 top
R20  10k  [0603]  77.67,15.42 180 top
R21  10k  [0603]  77.67,14.27 180 top
R22  47R  [0402]  52.72,43.27 0 top
R23  47R  [0402]  52.72,44.15 0 top
R24  47R  [0402]  52.72,45.03 0 top
R25  47R  [0402]  52.72,45.88 0 top
R26  47R  [0402]  52.72,48.62 0 top
R27  47R  [0402]  52.72,49.5 0 top
R28  47R  [0402]  52.72,50.37 0 top
R29  47R  [0402]  52.72,51.24 0 top
R30  47R  [0402]  52.73,54.23 0 top
R31  47R  [0402]  52.73,55.1 0 top
R32  47R  [0402]  52.73,55.95 0 top
R33  47R  [0402]  52.75,56.81 0 top
R34  47R  [0402]  52.75,59.69 0 top
R35  47R  [0402]  52.76,60.56 0 top
R36  47R  [0402]  52.76,61.43 0 top
R37  47R  [0402]  52.76,62.31 0 top
R38  47R  [0402]  96.09,18.8 180 top
R39  47R  [0402]  96.09,20.04 180 top
R40  47R  [0402]  96.09,22.38 180 top
R41  47R  [0402]  69.82,5.59 0 top
R42  47R  [0402]  69.82,4.32 0 top
R43  47R  [0402]  69.82,3.02 0 top
R44  47R  [0402]  84.41,2.31 270 top
R45  47R  [0402]  77.38,38.78 0 top
R46  360k  [0603]  73.99,30.9 0 bottom
R47  360k  [0603]  78.33,33.84 270 bottom
R48  0R1  [0603]  46.45,26.84 180 bottom
R49  0R1  [0603]  71.75,30.2 90 bottom
R50  0R1  [0603]  83.25,34.66 90 top
R51  0R1  [0603]  91.98,1.16 0 bottom
R52  43k  [0603]  45.29,3.39 270 top
R53  39k  [0603]  47.22,5.58 180 top
R54  36k  [0603]  39.98,16.21 270 top
R55  27k  [0603]  38.71,16.21 90 top
R56  200R  [0603]  71.46,72.28 0 top
R57  200R  [0603]  71.46,73.69 0 top
R58  4k7  [0603]  67.39,72.29 0 top
R59  4k7  [0603]  82.6,81.14 90 top
R60  NC  [0402]  73.18,84.65 180 top
R61  68k  [0603]  29.24,11.74 180 top
R62  15k  [0603]  29.22,14.25 0 top
R63  68k  [0603]  32.81,11.71 180 top
R64  15k  [0603]  32.81,14.24 0 top
R65  10k  [0603]  20.75,6.82 0 top
R66  10k  [0603]  20.73,4.16 180 top
R67  270  [0402]  82.6,90.94 90 top
R68  270  [0402]  85.13,90.94 90 top
R69  270  [0402]  87.69,90.94 90 top
R70  270  [0402]  90.23,90.94 90 top
R71  270  [0402]  92.75,90.94 90 top
R72  270  [0402]  95.3,90.94 90 top
R73  270  [0402]  97.8,90.94 90 top
R74  4k7  [0603]  67.4,73.67 0 top
R75  10k  [0603]  26.28,5.36 180 top
R76  10k  [0603]  26.3,7.91 0 top
R77  2k7  [0603]  26.29,9.19 180 top
R78  2k7  [0603]  20.73,8.14 180 top
R79  47R  [0402]  59.15,90.94 90 bottom
R80  150k  [0402]  80.94,89.11 90 top
R81  150k  [0402]  83.49,89.11 90 top
R82  150k  [0402]  86.01,89.11 90 top
R83  4k7  [0603]  71.44,70.88 0 top
R84  4k7  [0603]  67.38,70.94 180 top
R85  4k7  [0603]  71.5,75.15 0 top
R86  100R  [0402]  82.58,77.12 90 top
R87  68R  [0603]  79.15,69.12 0 top
R88  4k7  [0402]  83.02,86.81 180 top
R89  4k7  [0402]  63.17,61.67 180 bottom
R90  47R  [0402]  54,65.38 180 top
R91  4k7  [0603]  67.4,76.55 0 top
R92  4k7  [0603]  67.43,77.96 0 top
R93  4k7  [0603]  67.39,75.17 180 top
R94  200R  [0603]  71.46,76.53 0 top
R95  150k  [0402]  88.6,89.11 90 top
R96  150k  [0402]  91.1,89.11 90 top
R97  47R  [0402]  76.94,90.94 90 bottom
R98  47R  [0402]  74.4,90.94 90 bottom
R99  47R  [0402]  71.85,90.94 90 bottom
R100  47R  [0402]  69.32,90.94 90 bottom
R101  47R  [0402]  66.78,90.94 90 bottom
R102  47R  [0402]  64.24,90.93 90 bottom
R103  47R  [0402]  61.69,90.94 90 bottom
R104  4k7  [0603]  71.26,81.59 90 top
R105  200R  [0603]  71.5,77.94 0 top
R106  1k5  [0603]  38.99,78.92 0 top
R107  360k  [0603]  89.41,33.92 270 top
R108  4k7  [0402]  57.01,90.58 0 top
R109  4k7  [0402]  57.01,91.44 0 top
R110  4k7  [0402]  56.99,89.45 0 top
R111  4k7  [0402]  68.03,89.54 180 top
R112  240k  [0603]  87.28,34.73 0 top
R113  150k  [0402]  93.63,89.12 90 top
R114  150k  [0402]  96.18,89.11 90 top
R115  150k  [0402]  98.73,89.11 90 top
R116  100R  [0402]  80.53,87.81 180 top
R117  100R  [0402]  83,87.83 180 top
R118  100R  [0402]  85.53,87.83 180 top
R119  100R  [0402]  88.09,87.83 180 top
R120  100R  [0402]  90.6,87.83 180 top
R121  100R  [0402]  93.16,87.83 180 top
R122  100R  [0402]  95.73,87.83 180 top
R123  100R  [0402]  98.21,87.81 180 top
R124  51k  [0402]  98.68,90.97 270 top
R125  51k  [0402]  96.13,90.99 270 top
R126  51k  [0402]  93.59,90.99 270 top
R127  51k  [0402]  91.06,90.99 270 top
R128  51k  [0402]  88.55,90.99 270 top
R129  51k  [0402]  85.96,90.99 270 top
R130  51k  [0402]  83.44,90.99 270 top
R131  51k  [0402]  80.89,90.99 270 top
R132  1k5  [0603]  38.98,74.76 0 top
R133  1k5  [0603]  38.98,70.28 0 top
R134  1k5  [0603]  38.95,66.46 0 top
R135  3k  [0603]  38.99,81.44 0 top
R136  3k  [0603]  38.96,69 0 top
R137  3k  [0603]  38.96,67.74 0 top
R138  3k  [0603]  39,77.34 0 top
R139  22R  [0603]  47.91,68.94 90 top
R140  22R  [0603]  46.55,71.72 90 top
R141  22R  [0603]  47.9,77.95 90 top
R142  22R  [0603]  46.6,75.33 270 top
R143  10k  [0603]  52.56,65.1 270 bottom
R144  10k  [0603]  52.55,67.79 270 bottom
R145  4k7  [0603]  61.68,80.08 270 top
R146  1M  [0603]  69.78,82.41 90 top
R147  4k7  [0603]  60.43,80.08 90 top
R148  4k7  [0603]  60.4,83.05 90 top
R149  4k7  [0603]  61.66,83.06 90 top
R150  1M  [0603]  68.51,82.39 90 top
R151  4k7  [0603]  70.85,84.65 180 top
R152  100R  [0402]  82.59,74.17 270 top
R153  1M  [0603]  86.58,81.14 270 top
R154  100k  [0603]  85.25,81.14 270 top
R155  1k  [0603]  83.95,81.14 270 top
R156  68R  [0603]  87.89,81.14 270 top
R157  10k  [0603]  67.85,15.66 270 top
R158  10k  [0603]  67.85,12.8 270 top
R159  1k5  [0603]  66.17,7.99 90 bottom
R160  1k5  [0603]  64.78,14.59 90 top
R161  150R  [0603]  63.48,18.77 180 bottom
R162  150R  [0603]  50.78,16.57 0 bottom
R163  43k  [0603]  71.96,28.2 180 top
R164  30k  [0603]  71.96,30.7 0 top
R165  0R1  [0603]  69.91,28.86 90 top
R166  43k  [0603]  70.29,28.6 90 bottom
R167  30k  [0603]  70.28,25.96 90 bottom
R168  0R1  [0603]  64.89,30.36 0 bottom
R169  1M  [0402]  69.33,57.46 0 bottom
R170  75k  [0603]  35.36,3.29 270 top
R171  22k  [0603]  37.26,5.56 180 top
R172  0R1  [0603]  53.13,1.3 180 top
R173  0R1  [0603]  33.2,1.1 180 top
R174  0R1  [0603]  43.28,1.2 180 top
R175  75k  [0603]  40.93,6.04 270 top
R176  24k  [0603]  39.44,9.75 270 top
R177  0R1  [0603]  37.28,8.26 180 top
R178  0R1  [0603]  44.29,5.61 180 top
R179  0R1  [0603]  44.45,18.66 90 top
R180  0R1  [0603]  36.85,17.74 90 top
R181  4k7  [0603]  29.21,16.82 180 top
R182  4k7  [0603]  32.8,16.81 180 top
R183  0R1  [0603]  29.04,9.51 270 top
R184  0R1  [0603]  35.56,12.97 0 top
R185  0R1  [0603]  26.29,10.46 180 top
R186  0R1  [0603]  20.74,10.76 0 top
R187  100k  [0603]  22.01,2.35 180 top
R188  100k  [0603]  22.84,5.99 90 top
R189  4k7  [0603]  38.89,25.6 90 top
R190  4k7  [0603]  39.81,23.14 0 top
R191  4k7  [0603]  33.46,25.45 270 top
R192  0R1  [0603]  41.35,25.57 90 top
R193  0R1  [0603]  30.88,22.75 270 top
R194  4k7  [0603]  32.2,22.76 270 top
R195  910R  [0603]  33.45,19.49 270 top
R196  4k7  [0603]  30.91,19.48 270 top
R197  5k1  [0603]  32.16,19.48 90 top
R198  68k  [0603]  16.01,8.39 0 top
R199  15k  [0603]  15.99,9.71 180 top
R200  4k7  [0603]  15.99,12.34 0 top
R201  NC  [0402]  76.88,81.42 90 top
R202  91k  [0603]  1.55,32.35 90 top
R203  10k  [0603]  1.51,29.51 90 top
R204  27k  [0603]  5.79,27.38 90 top
R205  27k  [0603]  3.64,25.59 0 top
R206  22k  [0603]  3.63,26.84 180 top
R207  22k  [0603]  3.6,28.09 0 top
R208  200R  [0603]  27.31,36.66 0 top
R209  30R  [0603]  30.1,39.25 180 top
R210  20R  [0603]  31.91,40.04 270 top
R211  22R  [0603]  29.27,37.37 270 top
R212  300R  [0603]  26.95,45.47 0 top
R213  100R  [0603]  26.98,46.69 180 top
R214  22R  [0603]  30.03,43.03 180 top
R215  300R  [0603]  21.06,45.37 180 top
R216  300R  [0603]  21.8,47.28 270 top
R217  22R  [0603]  20.43,47.33 270 top
R218  10k  [0603]  25.13,46.24 270 top
R219  10k  [0603]  23.02,46.03 270 top
R220  10k  [0603]  25.46,42.98 180 bottom
R221  30k  [0603]  20.29,76.44 90 top
R222  30k  [0603]  21.04,73.03 180 top
R223  470k  [0603]  22.34,77.03 0 top
R224  470k  [0603]  23.08,72.25 90 top
R225  51k  [0603]  32.72,63.53 90 top
R226  39k  [0603]  33,61.55 0 top
R227  910k  [0603]  31.94,65.5 180 top
R228  1k  [0603]  30.21,61.55 0 top
R229  300R  [0603]  26.12,60.71 0 top
R230  300R  [0603]  23.5,60.69 0 top
R231  7R5  [0603]  27.49,59.49 180 top
R232  10R  [0603]  32.44,60.33 180 bottom
R233  10R  [0603]  34.32,80.83 0 bottom
R234  10R  [0603]  34.17,72.3 180 bottom
R235  10R  [0603]  34.32,82.05 180 bottom
R236  10R  [0603]  34.17,71.08 0 bottom
R237  22R  [0603]  26.53,53.56 180 top
R238  300R  [0603]  23.58,53.55 0 top
R239  22R  [0603]  20.48,54.9 270 top
R240  1R  [0603]  21.72,86.85 180 bottom
R241  100R  [0402]  27.82,89.57 0 bottom
R242  47R  [0603]  21.04,70.06 180 top
R243  47R  [0603]  28.94,64.29 270 top
R244  200R  [0603]  9.13,36.66 0 top
R245  30R  [0603]  11.92,39.25 180 top
R246  20R  [0603]  13.73,40.04 270 top
R247  22R  [0603]  11.08,37.37 270 top
R248  300R  [0603]  8.77,45.47 0 top
R249  100R  [0603]  8.8,46.69 180 top
R250  22R  [0603]  11.85,43.03 180 top
R251  300R  [0603]  2.88,45.37 180 top
R252  300R  [0603]  3.62,47.28 270 top
R253  22R  [0603]  2.24,47.33 270 top
R254  10k  [0603]  6.94,46.24 270 top
R255  10k  [0603]  4.84,46.03 270 top
R256  10k  [0603]  7.27,42.98 180 bottom
R257  30k  [0603]  2.11,76.44 90 top
R258  30k  [0603]  2.85,73.03 180 top
R259  470k  [0603]  4.16,77.03 0 top
R260  470k  [0603]  4.9,72.25 90 top
R261  130k  [0603]  14.54,63.53 90 top
R262  47k  [0603]  14.82,61.55 0 top
R263  820k  [0603]  13.75,65.5 180 top
R264  3k  [0603]  12.02,61.55 0 top
R265  300R  [0603]  7.93,60.71 0 top
R266  300R  [0603]  5.32,60.69 0 top
R267  7R5  [0603]  9.31,59.49 180 top
R268  10R  [0603]  14.26,60.33 180 bottom
R269  10R  [0603]  16.14,80.83 0 bottom
R270  10R  [0603]  15.99,72.3 180 bottom
R271  10R  [0603]  16.14,82.05 180 bottom
R272  10R  [0603]  15.99,71.08 0 bottom
R273  22R  [0603]  8.24,52.74 180 top
R274  300R  [0603]  5.39,53.55 0 top
R275  22R  [0603]  8.25,54.06 0 top
R276  1R  [0603]  3.54,86.85 180 bottom
R277  100R  [0603]  9.64,89.57 0 bottom
R278  22R  [0603]  2.85,70.06 180 top
R279  22R  [0603]  10.75,64.29 270 top
R280  1k  [0402]  53.26,97.36 180 bottom
R281  2k2  [0402]  51.48,97.36 0 bottom
R282  50R  [0603]  14.11,23.77 0 top
R283  1k6  [0603]  4.7,20.21 180 top
R284  820R  [0603]  2.01,18.94 180 top
R285  1k6  [0603]  4.71,18.94 0 top
R286  820R  [0603]  2.01,17.65 180 top
R287  820R  [0603]  2.01,16.36 180 top
R288  820R  [0603]  2,15.11 180 top
R289  820R  [0603]  2,13.84 180 top
R290  820R  [0603]  1.99,12.55 180 top
R291  820R  [0603]  1.99,11.29 180 top
R292  1k6  [0603]  1.96,9.99 180 top
R293  1k6  [0603]  4.71,17.65 0 top
R294  1k6  [0603]  4.68,16.38 0 top
R295  1k6  [0603]  4.65,15.1 0 top
R296  1k6  [0603]  4.65,13.84 0 top
R297  1k6  [0603]  4.64,12.56 0 top
R298  1k6  [0603]  4.64,11.29 0 top
R299  39R  [0603]  4.6,10 180 top
R300  300R  [0603]  13.31,21.69 90 top
SV1  2x5 Pinheader  [ML10]  61.12,34.61 0 top
SV2  2x8 Pinheader  [MA08-2W]  88.95,94.16 0 top
SV3  2x8 Pinheader  [MA08-2W]  68.05,94.16 0 top
SV4  2x8 Pinheader  [MA08-2W]  47.09,94.13 0 top
SV5  3x1 Pinheader  [MA03-1]  5.16,23.25 0 top
T1  EFD15DCDCPM5P33EFD15  [B66414-W1008-D1]  57.44,24.51 180 top
T2  BC850  [SOT23]  32.49,83.27 90 bottom
T3  BC850  [SOT23]  32.19,78.24 270 bottom
T4  BC850  [SOT23]  27.92,73.67 90 bottom
T5  BC856ASMD  [SOT23-BEC]  28.38,83.27 90 bottom
T6  BC856ASMD  [SOT23-BEC]  28.22,78.39 270 bottom
T7  BC856ASMD  [SOT23-BEC]  31.88,73.67 90 bottom
T8  BC850  [SOT23]  31.88,68.64 270 bottom
T9  BC856ASMD  [SOT23-BEC]  27.77,68.64 270 bottom
T10  BC850  [SOT23]  14.31,83.27 90 bottom
T11  BC850  [SOT23]  14,78.24 270 bottom
T12  BC856ASMD  [SOT23-BEC]  10.19,83.27 90 bottom
T13  BC856ASMD  [SOT23-BEC]  10.04,78.39 270 bottom
T14  BC850  [SOT23]  9.74,73.67 90 bottom
T15  BC856ASMD  [SOT23-BEC]  13.7,73.67 90 bottom
T16  BC850  [SOT23]  13.7,68.64 270 bottom
T17  BC856ASMD  [SOT23-BEC]  9.59,68.64 270 bottom
U2  6SLX9FTG256  [FT256]  67.71,53.31 180 top
X1  MINI-USB-32005-201  [32005-201]  92.64,4.96 90 top
X2  31-5431-10RFX  [AMP_227161]  26.85,92.72 0 top
X3  31-5431-10RFX  [AMP_227161]  8.67,92.72 0 top

## Tracks (layer width: path | path; a pad name or v marks a point on that pad's centre or on a via)
1V2REF  (via drill 0.3)
  Top 0.2: 31.08,11.15 31.08,11.75 30.68,12.15 30.68,17.45 30.48,17.65 29.08,17.65 28.69,18.04 28.69,21.05 C194.1
  Top 0.254: R193.2 C194.1 | IC18.3 32.34,8.78 32.98,8.14 33.41,8.14 | 33.41,8.14 IC18.5 | IC31.5 17.14,3.88 v18.26,2.75 | v33.41,7.26 33.41,8.14
  Top 0.305: IC18.3 31.6,8.78 31.94,9.11 31.94,10.2 31.94,10.29 31.08,11.15
  Top 0.61: L9.1 v41.39,54.15 v41.4,54.14 | v32.14,9.99 v32.14,10 31.94,10.2 | L10.1 v41.44,43.23
  Route3 0.61: v41.4,54.14 41.4,53.2 41.05,52.85 40.28,52.85 39.55,52.12 39.55,51.3 40.09,50.76 42.83,50.76 43.24,50.35 43.24,43.31 | 43.24,43.31 43.24,40.74 37.26,34.76 37.26,27 36.13,25.86 36.13,20.85 33.23,17.95 33.21,11.01 v32.14,9.99 | v41.44,43.23 43.15,43.23 43.24,43.31
  Bottom 0.254: v18.26,2.75 21.6,2.75 22.4,1.95 24.43,1.95 24.84,2.36 26.08,2.36 26.89,1.55 33.85,1.55 34.76,2.46 34.76,5.91 v33.41,7.26
1V2REFAD0
  Top 0.305: IC5.10 44,45.57 43.88,45.45 42.69,45.45 C111.1 41.74,45.3 L10.2
1V2REFAD1
  Top 0.305: IC6.10 42.76,56.62 C108.1 41.7,56.29 L9.2
2V8REF  (via drill 0.3)
  Top 0.254: R195.1 33.69,20.27 33.94,20.02 36.68,20.02 | IC30.8 | IC30.8 37.34,21.06 C193.2 | R190.1 37.84,23.14 36.98,22.27 36.98,21.07 IC30.8
  Top 0.305: IC30.8 36.96,20.31 36.68,20.02 36.05,19.4 34.71,19.4 34.5,19.19 34.5,17.91 34.68,17.74 36.71,17.74 36.85,17.6 R180.1
  Top 0.406: R190.1 37.19,23.14 v37.18,23.12
  Top 0.6: C177.2 36.98,16.82 R180.1
  Top 0.61: v40.08,62.7 L8.1 | L8.1 | L11.1 v40.41,51.75 | v40.41,51.75
  Route3 0.61: v37.18,23.12 37.18,24.64 38.11,25.57 38.11,34.14 44.43,40.45 44.43,51.7 | 44.43,51.7 44.43,61.79 43.5,62.71 40.09,62.71 v40.08,62.7 | v40.41,51.75 44.38,51.75 44.43,51.7
2V8REFAD0
  Top 0.254: IC5.3 44.09,50.12 43.9,50.33 42.69,50.33
  Top 0.305: 42.69,50.33 C109.1 41.72,50.55 L11.2
2V8REFAD1
  Top 0.254: IC6.3 44.11,61.17 43.9,61.39 42.37,61.39
  Top 0.305: 42.37,61.39 C106.1 41.56,61.42 L8.2
3V3A  (via drill 0.3, 0.6)
  Top 0.254: IC31.8 C197.2
  Top 0.305: IC5.1 44.34,51.42 43.98,51.78 43.51,51.78 C63.1 | C64.1 43.62,49.47 IC5.4 46.41,49.47 46.38,49.6 | C65.1 43.64,43.74 44.11,44.21 44.33,44.22 IC5.12 45.57,44.27 45.58,44.26 | IC6.1 44.19,62.47 43.83,62.83 43.51,62.83 C68.1 | C69.1 43.59,60.52 IC6.4 45.63,60.52 v45.63,60.67 | IC6.12 44.14,55.32 43.83,55.01 43.56,55.01 C67.1 | IC41.8 6.57,56.41 v6.18,56.8
  Top 0.406: C66.1 45.37,52.29 IC5.1 | 46.57,44.06 45.76,44.09 45.58,44.26 | 46.41,49.47 46.61,49.47 46.69,49.39 | IC6.12 44.92,55.32 45.16,55.08 45.16,55.04 45.21,54.99 | IC36.8 24.82,55.19 25.35,55.19 26.19,56.03 C218.2 24.58,56.52 v24.3,56.8
  Top 0.48: v50.05,28.86 50.05,28.07 45.98,24 45.98,12.62 45.5,12.15 45.5,10.79 v45.33,10.61 | v14.5,4.28 13.96,4.74 C197.2
  Top 0.61: 43.83,62.83 43.83,63.44 44.21,63.84 | C70.1 44.39,63.59 44.21,63.84 | C66.1 45.37,53.52 45.41,53.88 | 46.53,42.05 46.57,44.06 | 48.56,64.06 48.11,64.53 44.61,64.53 44.2,64.1 44.2,63.84 44.21,63.84 | v45.63,60.67 46.74,60.67 46.9,60.51 | 47.16,54.31 47.16,54.19 47.18,54.17 | 45.21,54.99 45.21,54.54 45.58,54.17 | v6.18,56.8 7.73,56.8 C243.2 | v20.01,30.61 6.51,30.61 v6.29,30.84
  Top 0.813: 46.69,49.39 46.69,43.88 46.54,43.73 46.54,43.41 46.53,42.05 | 45.41,53.88 45.47,54.07 45.58,54.17 47.18,54.17 47.43,54.17 48.34,53.26 48.34,51.76 | 48.34,51.76 48.34,51.61 46.98,50.25 46.98,49.84 46.61,49.47 | 48.56,64.06 48.56,62.8 46.9,61.14 46.9,60.51 46.9,57.25 47.14,57.01 47.14,54.34 47.16,54.31 | v45,32.42 45,32.4 44.96,32.36 43.59,32.36 43.14,31.91 38.69,31.91 38.24,32.36 26,32.36 25.65,32.01 25.65,30.96 v25.25,30.56 | 46.53,42.05 46.53,40.38 45,38.84 | L4.1 46.64,41.95 46.53,42.05 | L5.1 48.29,51.81 48.34,51.76
  Top 1.016: v45,32.42 45,38.84
  Route2 0.61: v2.19,36.58 2.19,38.41 3.16,39.38 3.16,41.36 2.88,41.64 2.88,50.15 3.41,50.53 4.17,50.53 4.94,51.21 7.4,51.21 7.78,51.67 7.78,55.2 v6.18,56.8 | v24.3,56.8 24.35,56.8 25.61,55.54 25.61,51.99 24.94,51.31 21.56,51.31 21.04,50.79 21.04,50.77 20.93,50.66 20.93,42.01 21.49,41.45 21.49,40.12 v19.51,38.15
  Route3 0.406: 50.04,28.86 v50.05,28.86
  Route3 1.016: 50.04,28.86 50.04,28.73 49.41,28.1 44.49,28.1 42.81,29.77 42.81,31.43 43.81,32.42 v45,32.42
  Bottom 0.406: C88.2 44.91,32.51 v45,32.42 | 3.88,34.99 2.75,36.11 2.66,36.11 v2.19,36.58
  Bottom 0.48: v45.33,10.61 44.95,10.61 44.58,10.24 44.58,8.09 43.65,7.16 36.88,7.16 35.58,8.46 33.01,8.46 31.71,7.16 31.58,7.01 29.93,5.26 29.94,4.03 28.5,2.59 27.19,2.59 26.15,3.62 15.15,3.62 v14.5,4.28
  Bottom 0.61: 3.88,34.99 3.88,33.24 v6.28,30.84 v6.29,30.84 | v19.51,38.15 19.51,37.9 20.43,36.99 20.43,31.02 v20.01,30.61
  Bottom 0.8: 64.04,30.3 R168.2 | 51.49,30.3 v50.05,28.86
  Bottom 0.813: 64.04,30.3 51.49,30.3 | v25.25,30.56 20.89,30.56 20.43,31.02
+3.6V  (via drill 0.6)
  Top 0.6: 44.45,20.1 v44.41,20.39 44.45,20.35 R179.2
  Bottom 0.406: 46.83,16.87 47.09,16.61 C160.1 47.38,16.48 47.06,16.16
  Bottom 0.6: v44.41,20.39 44.68,20.62 45.19,20.62
  Bottom 0.61: 45.25,26.85 45.65,26.85 R48.1
  Bottom 1.016: C161.+ 46.52,19.29 45.19,20.62 44.81,21 44.81,26.41 45.25,26.85
  Bottom 1.27: C161.+ 46.83,16.87 | 47.06,16.16 47.09,16.14 47.09,14.94 D5.C 46.82,12.96 D6.C
+3.6VBR  (via drill 0.3, 0.6)
  Top 0.254: IC11.3 74.81,23.99 75.44,23.36 75.44,22.2 75.09,21.91 73.03,21.91 72.88,22.09 72.86,22.73 C84.2
  Top 0.406: C84.2 72.83,24.1 IC11.1 | v72,22.59 72,23.2 71.98,23.23
  Top 0.61: IC1.3 87.99,36.08 88.18,36.26 88.18,37.65 87.86,37.96 87.75,37.9 86.85,37.96 IC1.1 86.5,38.31 C3.2 | IC11.1 72.91,23.66 72.48,23.23 71.98,23.23 70.83,23.23 69.85,24.2 69.85,26.39 68.53,27.71 v68.53,29.52
  Top 0.813: v88.18,37.94 87.89,37.92 87.91,37.88 87.75,37.9
  Route3 0.305: v77.75,35.85 77.75,36.54
  Route3 0.61: v75.5,24.04 73.45,24.04 v72,22.59
  Route3 0.813: v88.18,37.94 86.8,36.5 78.84,36.49 78.5,36.5 77.75,36.54 71.5,36.56 v70.76,37.06
  Bottom 0.254: IC12.3 72.9,22.15 73.1,21.95 74.43,21.95 C162.2 | IC10.3 77.11,35.85 v77.75,35.85
  Bottom 0.406: IC12.1 75.39,24.15 v75.5,24.04
  Bottom 0.61: IC10.1 75.17,37.33 C80.2 | v68.53,29.52 68.53,30.15 67.48,31.65 | C162.2 75.24,23.09 74.85,23.48 74.85,24.1 IC12.1
  Bottom 0.813: R48.2 48.45,26.84 48.74,27.12 48.74,29.89 50.31,31.62 67.48,31.65 68.35,30.39 67.65,31.55 67.65,32.48 67.68,33.59 67.73,36.16 68.35,37.05 v70.76,37.06 71.29,37.05 74.3,37.05 C80.2
+3.6VI
  Top 0.2: IC7.3 41.16,20.43 40.71,19.98 40.71,18.96 41.01,18.66 41.49,18.66 IC7.1
  Top 0.6: R179.1 43.21,17.88 C94.2 43.16,17.93 42.66,17.93 42.06,18.52 IC7.1
+3V3  (via drill 0.3, 0.6)
  Top 0.15: U2.H6 70.24,52.81 v70.59,53.2 | U2.E5 71.24,49.81 | U2.L6 70.14,55.81 v69.64,55.31 | R10.1 R11.1 76.33,64.33 v76.36,64.36
  Top 0.2: U2.D15 61.21,48.84 v61.7,49.33 | U2.J15 61.24,53.81 v61.69,53.36 | U2.G13 v63.61,52.27 | U2.N15 v61.61,57.42 | v63.71,55.29 63.69,55.29 U2.K13 | v62.71,60.31 U2.R13 | R8.1 66.56,66.09 IC2.7 IC2.8
  Top 0.254: IC2.3 v62.87,64.97 v62.88,64.98 | R6.1 62.48,69.08 v62.7,69.31 | IC13.24 57.77,71.8 57.94,71.62 59.33,71.62 | 59.33,71.62 59.45,71.75 C116.1 | IC13.25 58.41,72.44 C117.1 58.62,72.33 59.26,72.33 59.33,72.26 59.33,71.62 | IC20.14 73.8,80.01 73.61,79.83 73.61,79.04 73.79,78.86 73.86,78.83 74.4,78.83 C147.2
  Top 0.305: 71.24,49.81 v71.64,50.23 | U2.A4 72.21,45.92 v72.3,46.27 72.21,46.48 U2.B4 U2.B5 U2.C5 71.2,47.8 v70.71,47.8 70.7,47.81 U2.C6 U2.D6 70.09,48.69 69.56,48.69 69.49,48.76 69.29,48.76 69.24,48.81 U2.D7 | U2.F8 68.18,50.81 68.04,50.67 67.35,50.67 U2.F9 v66.71,51.31 | U2.L9 67.21,55.88 v67.5,56.23 | U2.R8 68.21,59.86 v68.68,60.33 | U2.N10 66.21,57.85 v65.83,57.44 | U2.N7 69.21,57.85 v68.75,58.34 | U2.R4 72.21,59.88 v71.78,60.31 | C26.1 68.04,67.77 v68.38,68.16 | 73.86,78.83 74.1,78.83 74.39,78.58 74.41,78.55 74.41,78.53 74.76,78.17 74.85,78.16 75.9,78.16 75.94,78.12 76.41,78.12 v76.43,78.11 | v80.16,81.19 80.18,82.21 v82.36,84.4 | 59.33,71.62 59.41,71.62 v59.66,71.37
  Top 0.406: IC3.16 73.85,7.72 C37.1 | U2.B4 72.15,46.81 | U2.B9 67.24,46.81 v67.61,47.19 | U2.G10 v66.71,51.31 | U2.J10 66.21,53.84 v65.71,54.34 | U2.F11 65.13,50.81 v64.64,51.31 | C34.1 73.4,62.99 v73.4,62.34 | C35.1 72.59,68.33 72.26,68 71.55,68 v71.54,67.99 | U2.D10 66.24,48.81 v66.71,48.34 | C26.1 66.49,67.43 IC2.8 | U2.B13 v62.78,47.31 | C23.1 63.06,69.28 v62.7,69.31 | C24.1 59.39,65.08 v59.46,65.15
  Top 0.61: QG1.4 73.06,36.84 71.71,36.84 C38.1
  Top 0.8: C82.2 55.98,35.93 SV1.2
  Top 0.813: C37.1 72.35,7.72 72.34,7.72 72.33,7.74 72.26,7.74 72.06,7.95 71.56,7.95 v71.58,7.95 | v70.04,30.5 69.94,30.2 69.94,29.68 R165.2
  Top 1.016: v70.04,30.5 69.73,30.5 68.68,31.55 68.68,31.7 | 68.68,31.7 68.68,31.96 69.23,32.51 71.01,32.51 72.19,33.69 72.19,33.91 73.11,34.84 73.11,36.79 73.06,36.84 | 68.68,31.7 54.08,31.7 53.54,32.24 53.54,33.67 55.75,35.89 55.84,35.89 55.85,35.88 | 55.85,35.88 55.86,35.86 | SV1.2 55.85,35.88
  Route3 0.813: v71.58,7.95 71.04,7.96 69.39,9.31 69.39,22.32 70.05,22.95 70.05,30.23 v70.04,30.5
  Bottom 0.15: v70.59,53.2 70.7,53.29 70.66,53.33 | v69.64,55.31 69.73,55.31 69.7,55.29 | R12.1 62.85,61.35 R89.1 | 62.68,60.42 62.69,60.45 v62.71,60.31
  Bottom 0.2: R89.1 62.68,60.42
  Bottom 0.254: IC9.1 IC9.2 84.39,89.4 84.24,89.55 | C33.1 72.19,60.72 v71.78,60.31
  Bottom 0.305: 61.7,57.33 v61.61,57.42 | 70.66,53.04 v70.59,53.2 | v76.43,78.11 77.86,78.11 80.15,80.4 v80.16,81.19 | v82.36,84.4 82.84,84.4 82.99,84.55
  Bottom 0.406: 61.64,53.31 v61.69,53.36 | 61.6,57.51 v61.61,57.42 | C22.1 63.55,52 | C164.2 70.66,53.04 | C165.2 67.61,47.86 v67.61,47.19 67.52,47.1 C166.2 | C28.1 64.55,51.39 v64.64,51.31 | v65.71,54.34 C25.1 | 62.81,60.23 v62.71,60.31
  Bottom 0.61: C72.1 61.13,57.88 61.49,57.51 61.6,57.51 | 63.55,52 v63.61,52.27
  Bottom 0.813: C73.1 60.84,48.46 v61.7,49.33 | 84.24,89.55 83.45,89.55 82.54,88.79 82.54,85.03 82.99,84.55 C76.1
  Bottom 1.016: C71.1 61.64,53.31
  pour Route3 (isolate 0.15): 72.09,45.48 72.11,48.27 71.96,48.48 71.73,53.42 71.66,53.56 71.66,56.34 71.65,56.6 71.65,59.31 74.21,61.88 74.25,63.92 74.36,64.04 76.91,64.04 77.06,64.15 96.81,64.15 98.8,66.14 98.8,92.12 96.58,94.35 59.31,94.35 58.74,93.78 58.74,89.62 59.7,88.66 70.08,88.66 70.8,87.94 73.23,87.94 75.98,85.19 80.8,85.19 81.99,84 82.85,84 83.96,85.11 95.56,85.19 96.25,84.5 96.25,69.03 94.69,67.46 75.21,67.47 72.86,69.89 59.98,69.85 59.98,71.55 59.51,72.01 59.14,72.01 58.8,71.67 58.85,67.71 58.85,43.12 54.53,38.8 53.25,38.8 52.54,38.09 52.54,32.05 52.9,31.69 67.31,31.69 68.3,32.67 68.3,43.2 67.65,43.85 67.68,45.79 68.01,46.17 68.95,46.17 68.95,46.52 68.81,46.66 68.36,46.98 68.31,49.77 68.15,49.94 67.7,50 67.26,50.36 67.21,50.71 67.1,50.9 66.33,51.65 65.94,51.71 65.6,52.09 65.56,53.81 65.58,53.94 65.58,54.25 65.33,54.46 64.95,54.91 64.9,55.51 65.11,55.75 65.11,55.76 65.21,55.94 68.79,55.9 69.45,55.08 69.5,55.01 69.79,54.58 69.73,51.24 68.79,50.23 68.79,47.31 69.75,46.35 69.75,45.74 70.14,45.35 72.09,45.35
+5.5V  (via drill 0.6)
  Top 0.813: C156.1 62.85,3.76 62.56,3.47 62.07,3.47 | 62.07,3.47 C157.+ 61.21,2.04 v63.32,2.04 | v61.37,4.75 61.37,4.17 62.07,3.47 | v45.08,6.71 R178.1
  Bottom 0.406: 49.65,5.71 49.35,5.71 49.29,5.78 47.99,5.78 47.98,5.76
  Bottom 0.813: 61.67,2.95 62.26,2.95 v63.32,2.04 | 53.77,4.79 50.57,4.79 49.65,5.71 | 47.98,5.76 46.05,5.76 v45.08,6.71
  Bottom 1.016: D1.C 53.77,4.79 54.17,5.2 60.77,5.2 61.67,4.29 61.67,2.95 D2.C
+5.5VI
  Top 0.2: IC29.3 42.73,9.93 42.5,9.7 42.5,8.45 42.89,8.06 43.36,8.06 IC29.1
  Top 0.6: C173.2 44.65,8.03 IC29.1 43.5,7.92 R178.2
+5V  (via drill 0.3)
  Top 0.15: 35.29,37.75 34.8,38.24 | IC44.10 11.45,11.3 10.96,11.79 10.96,16.18 11.79,17 14.58,17 14.94,17.36 14.94,18.81 C256.1 | 33.28,33.85 32.99,33.85 32.98,33.7
  Top 0.254: IC18.8 35.45,10.08 | 35.45,10.08 35.99,10.08 C170.2 | C104.2 35.34,10.19 35.45,10.08 | C139.1 67.35,90.36 IC32.8 65.51,90.36 v65.18,90.72 | IC20.15 74.3,79.68 C145.1 75.02,79.83 | C204.2 2.86,34.38 IC25.8 IC25.7
  Top 0.305: IC19.8 C112.2 | IC13.8 50.33,71.13 v50.78,70.81 | IC13.6 51.18,72.44 v51.41,72.21 | IC23.8 41.07,82.79 C125.1 | IC16.8 55.18,84.53 C138.1 | 74.3,79.68 74.4,79.68 v74.41,79.66 | 14.18,21.68 12.44,21.68 12.03,22.09 10.29,22.09 9.99,22.39 9.99,23.34 IC43.5